# Altium project 20bit_40MS_ADC_DIOT.PrjPcb (part 3 of 5)

## Sheet Optocouplers.SchDoc: Optoisolators
size A3; Author: M.Beldyga; CompanyName: WUT ISE; DrawnBy: M.Beldyga; Organization: WUT ISE; Address1: PW ISE; Address2: Nowowiejska 15/19 00-665 Warsaw; Address3: micbeldyga@gmail.com; SheetNumber: 7; SheetTotal: 10; ModifiedBy: -; CheckedDate: -; DivGrp: WUT ISE; Designer: M.Beldyga; ModifiedDate: -; ProjectName: Sensor Box
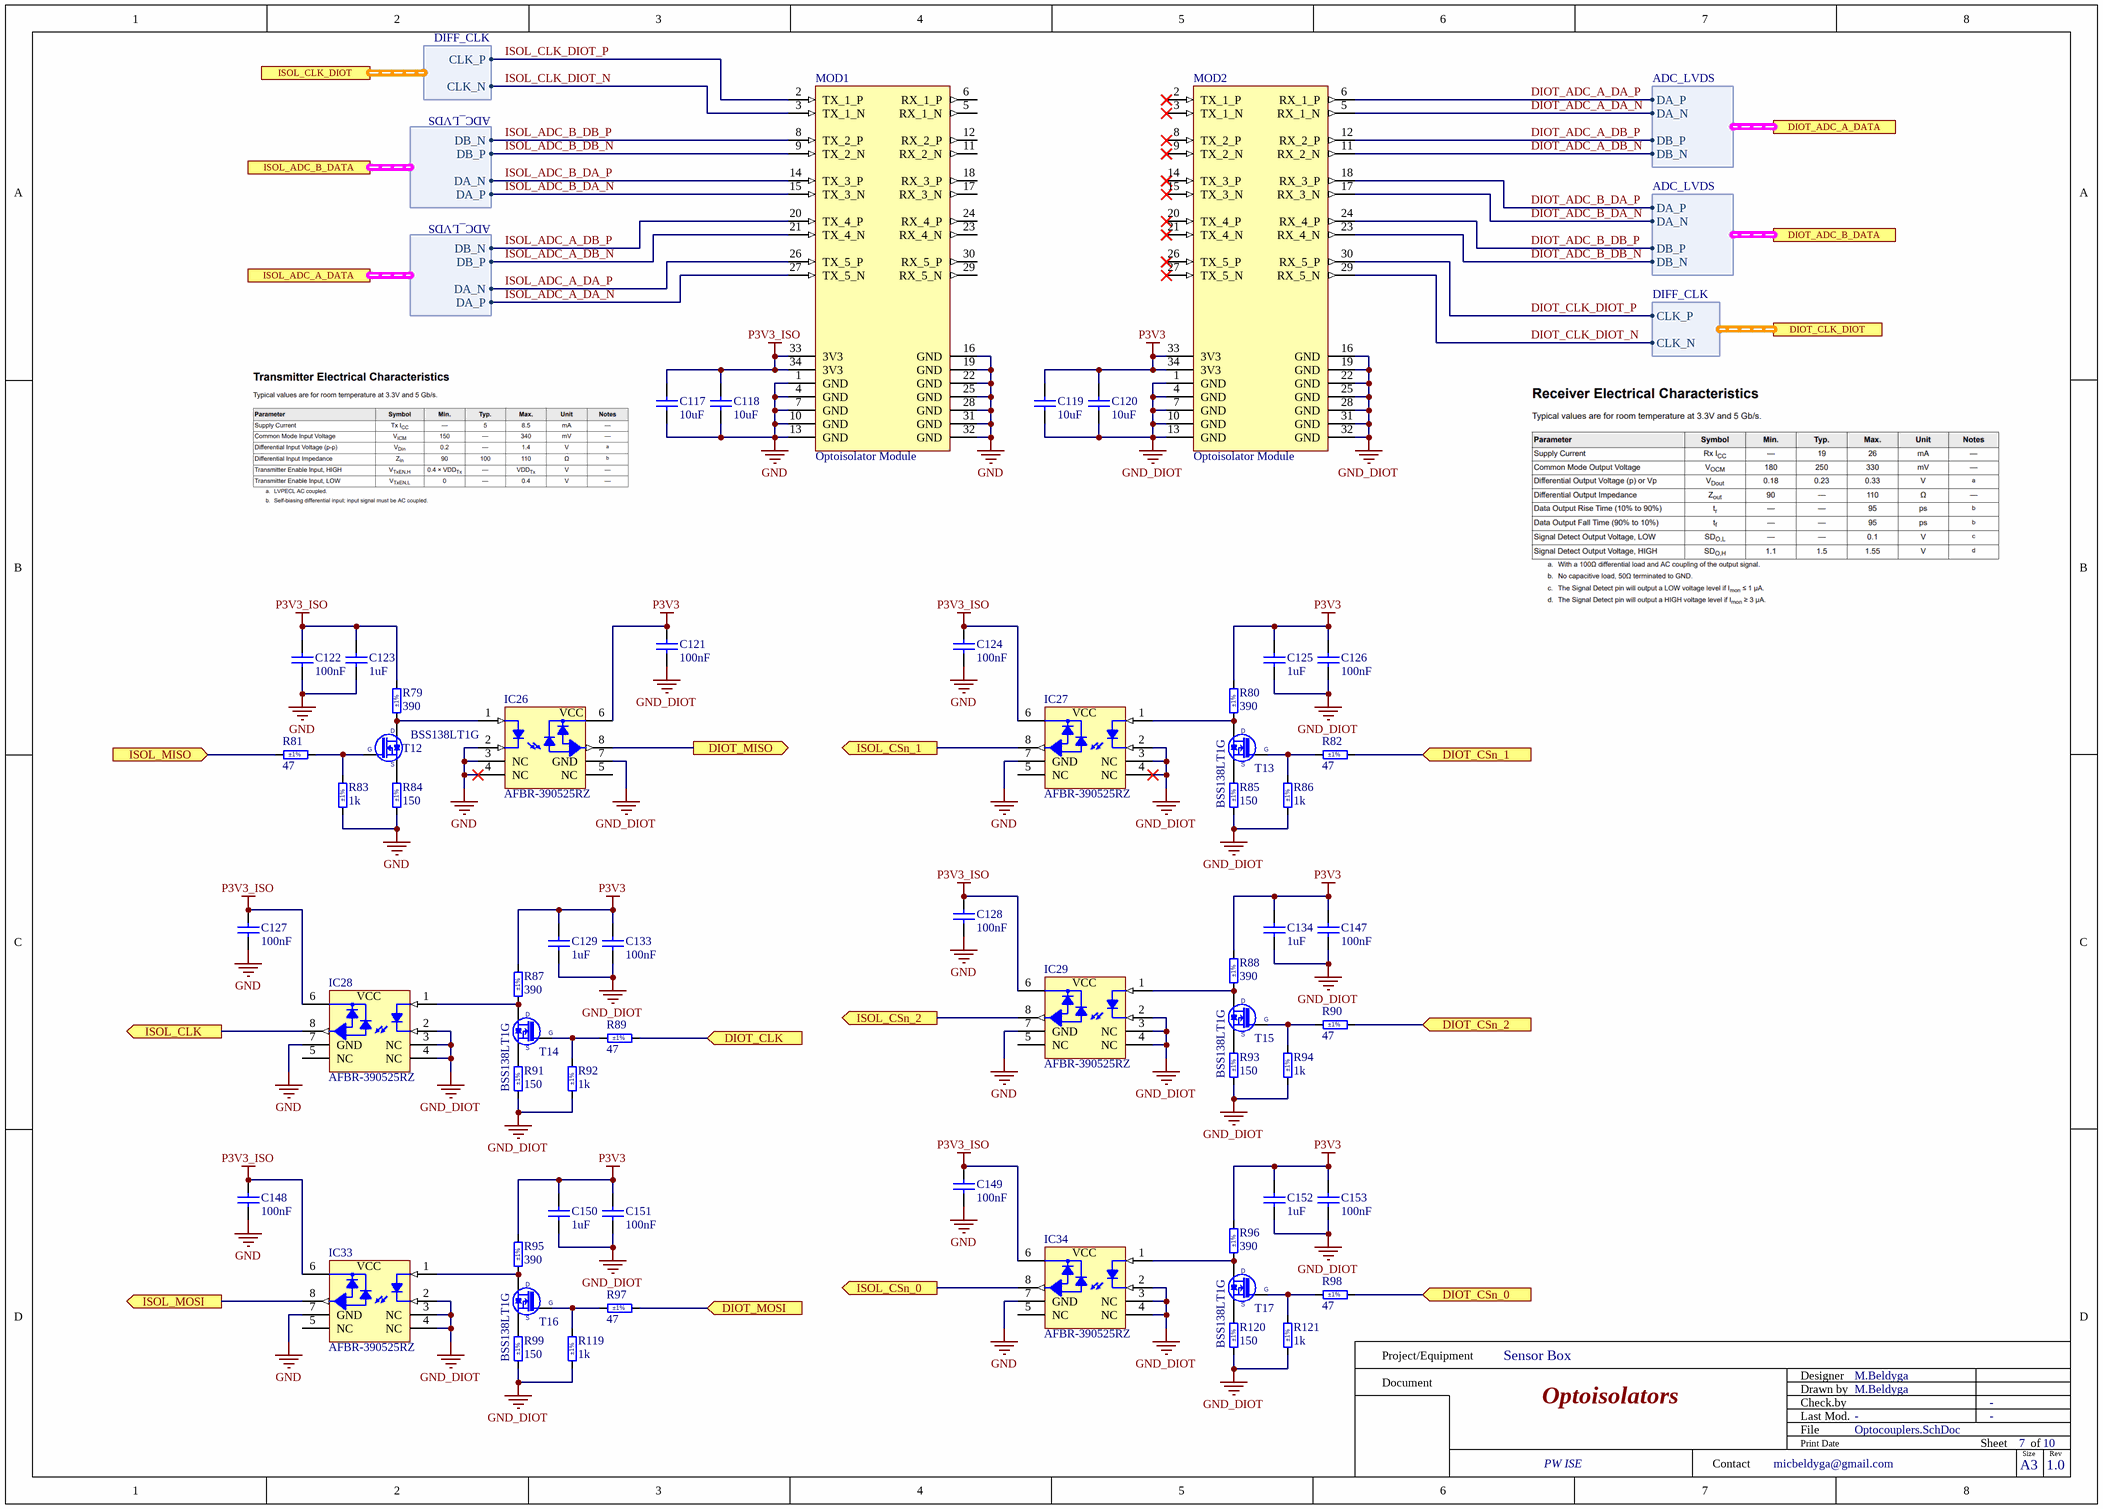
[diagram p7: Optocouplers.SchDoc]

### Parts
C117  10uF  [CAPC2012X95N]
C118  10uF  [CAPC2012X95N]
C119  10uF  [CAPC2012X95N]
C120  10uF  [CAPC2012X95N]
C121  100nF  [CAPC1005X55N]
C122  100nF  [CAPC1005X55N]
C123  1uF  [CAPC1005X55N]
C124  100nF  [CAPC1005X55N]
C125  1uF  [CAPC1005X55N]
C126  100nF  [CAPC1005X55N]
C127  100nF  [CAPC1005X55N]
C128  100nF  [CAPC1005X55N]
C129  1uF  [CAPC1005X55N]
C133  100nF  [CAPC1005X55N]
C134  1uF  [CAPC1005X55N]
C147  100nF  [CAPC1005X55N]
C148  100nF  [CAPC1005X55N]
C149  100nF  [CAPC1005X55N]
C150  1uF  [CAPC1005X55N]
C151  100nF  [CAPC1005X55N]
C152  1uF  [CAPC1005X55N]
C153  100nF  [CAPC1005X55N]
IC26  AFBR-390525RZ  [BROADCOM_AFBR-390525RZ]
IC27  AFBR-390525RZ  [BROADCOM_AFBR-390525RZ]
IC28  AFBR-390525RZ  [BROADCOM_AFBR-390525RZ]
IC29  AFBR-390525RZ  [BROADCOM_AFBR-390525RZ]
IC33  AFBR-390525RZ  [BROADCOM_AFBR-390525RZ]
IC34  AFBR-390525RZ  [BROADCOM_AFBR-390525RZ]
MOD1  Optoisolator Module  [Optoisolator_module]
MOD2  Optoisolator Module  [Optoisolator_module]
R79  390  Tolerance: ±1%  [RESC1005X40N]
R80  390  Tolerance: ±1%  [RESC1005X40N]
R81  47  Tolerance: ±1%  [RESC1005X40N]
R82  47  Tolerance: ±1%  [RESC1005X40N]
R83  1k  Tolerance: ±1%  [RESC1005X40N]
R84  150  Tolerance: ±1%  [RESC1005X40N]
R85  150  Tolerance: ±1%  [RESC1005X40N]
R86  1k  Tolerance: ±1%  [RESC1005X40N]
R87  390  Tolerance: ±1%  [RESC1005X40N]
R88  390  Tolerance: ±1%  [RESC1005X40N]
R89  47  Tolerance: ±1%  [RESC1005X40N]
R90  47  Tolerance: ±1%  [RESC1005X40N]
R91  150  Tolerance: ±1%  [RESC1005X40N]
R92  1k  Tolerance: ±1%  [RESC1005X40N]
R93  150  Tolerance: ±1%  [RESC1005X40N]
R94  1k  Tolerance: ±1%  [RESC1005X40N]
R95  390  Tolerance: ±1%  [RESC1005X40N]
R96  390  Tolerance: ±1%  [RESC1005X40N]
R97  47  Tolerance: ±1%  [RESC1005X40N]
R98  47  Tolerance: ±1%  [RESC1005X40N]
R99  150  Tolerance: ±1%  [RESC1005X40N]
R119  1k  Tolerance: ±1%  [RESC1005X40N]
R120  150  Tolerance: ±1%  [RESC1005X40N]
R121  1k  Tolerance: ±1%  [RESC1005X40N]
T12  BSS138LT1G  [SOT95P240X110-3N]
T13  BSS138LT1G  [SOT95P240X110-3N]
T14  BSS138LT1G  [SOT95P240X110-3N]
T15  BSS138LT1G  [SOT95P240X110-3N]
T16  BSS138LT1G  [SOT95P240X110-3N]
T17  BSS138LT1G  [SOT95P240X110-3N]

### Ports
DIOT_ADC_A_DATA (harness ADC_LVDS), DIOT_ADC_B_DATA (harness ADC_LVDS), DIOT_CLK (in), DIOT_CLK_DIOT (harness DIFF_CLK), DIOT_CSn_0 (in), DIOT_CSn_1 (in), DIOT_CSn_2 (in), DIOT_MISO (out), DIOT_MOSI (in), ISOL_ADC_A_DATA (harness ADC_LVDS), ISOL_ADC_B_DATA (harness ADC_LVDS), ISOL_CLK (out), ISOL_CLK_DIOT (harness DIFF_CLK), ISOL_CSn_0 (out), ISOL_CSn_1 (out), ISOL_CSn_2 (out), ISOL_MISO (in), ISOL_MOSI (out)

### Harnesses
DIFF_CLK: CLK_P, CLK_N
ADC_LVDS: DA_P, DA_N, DB_P, DB_N

### Nets
GND: C117.1 C118.1 C119.1 C120.1 C121.1 C122.1 C123.1 C124.1 C125.1 C126.1 C127.1 C128.1 C129.1 C133.1 C134.1 C147.1 C148.1 C149.1 C150.1 C151.1 C152.1 C153.1 IC26.2(C) IC26.3(NC) IC26.4(NC) IC26.7(GND) IC27.2(C) IC27.3(NC) IC27.4(NC) IC27.7(GND) IC28.2(C) IC28.3(NC) IC28.4(NC) IC28.7(GND) IC29.2(C) IC29.3(NC) IC29.4(NC) IC29.7(GND) IC33.2(C) IC33.3(NC) IC33.4(NC) IC33.7(GND) IC34.2(C) IC34.3(NC) IC34.4(NC) IC34.7(GND) MOD1.1(GND) MOD1.4(GND) MOD1.7(GND) MOD1.10(GND) MOD1.13(GND) MOD1.16(GND) MOD1.19(GND) MOD1.22(GND) MOD1.25(GND) MOD1.28(GND) MOD1.31(GND) MOD1.32(GND) MOD2.1(GND) MOD2.4(GND) MOD2.7(GND) MOD2.10(GND) MOD2.13(GND) MOD2.16(GND) MOD2.19(GND) MOD2.22(GND) MOD2.25(GND) MOD2.28(GND) MOD2.31(GND) MOD2.32(GND) R83.1 R84.1 R85.1 R86.1 R91.1 R92.1 R93.1 R94.1 R99.1 R119.1 R120.1 R121.1  [also labelled GND_DIOT]
P3V3: C119.2 C120.2 C121.2 C125.2 C126.2 C129.2 C133.2 C134.2 C147.2 C150.2 C151.2 C152.2 C153.2 IC26.6(VCC) MOD2.33(3V3) MOD2.34(3V3) R80.2 R87.2 R88.2 R95.2 R96.2
P3V3_ISO: C117.2 C118.2 C122.2 C123.2 C124.2 C127.2 C128.2 C148.2 C149.2 IC27.6(VCC) IC28.6(VCC) IC29.6(VCC) IC33.6(VCC) IC34.6(VCC) MOD1.33(3V3) MOD1.34(3V3) R79.2
ADC_SCLK: IC28.8(DATA_OUT) ; port ISOL_CLK
ADC_SDI: IC33.8(DATA_OUT) ; port ISOL_MOSI
CSn_0: IC34.8(DATA_OUT) ; port ISOL_CSn_0
CSn_1: IC27.8(DATA_OUT) ; port ISOL_CSn_1
CSn_2: IC29.8(DATA_OUT) ; port ISOL_CSn_2
DIOT_ADC_A_DA_N: MOD2.5(RX_1_N) ; port DIOT_ADC_A_DATA.DA_N
DIOT_ADC_A_DA_P: MOD2.6(RX_1_P) ; port DIOT_ADC_A_DATA.DA_P
DIOT_ADC_A_DB_N: MOD2.11(RX_2_N) ; port DIOT_ADC_A_DATA.DB_N
DIOT_ADC_A_DB_P: MOD2.12(RX_2_P) ; port DIOT_ADC_A_DATA.DB_P
DIOT_ADC_B_DA_N: MOD2.17(RX_3_N) ; port DIOT_ADC_B_DATA.DA_N
DIOT_ADC_B_DA_P: MOD2.18(RX_3_P) ; port DIOT_ADC_B_DATA.DA_P
DIOT_ADC_B_DB_N: MOD2.23(RX_4_N) ; port DIOT_ADC_B_DATA.DB_N
DIOT_ADC_B_DB_P: MOD2.24(RX_4_P) ; port DIOT_ADC_B_DATA.DB_P
DIOT_CLK_DIOT_N: MOD2.29(RX_5_N) ; port DIOT_CLK_DIOT.CLK_N
DIOT_CLK_DIOT_P: MOD2.30(RX_5_P) ; port DIOT_CLK_DIOT.CLK_P
DIOT_CSn_0: R98.2 ; port DIOT_CSn_0
DIOT_CSn_1: R82.2 ; port DIOT_CSn_1
DIOT_CSn_2: R90.2 ; port DIOT_CSn_2
DIOT_SPI_CLK: R89.2 ; port DIOT_CLK
DIOT_SPI_MISO: IC26.8(DATA_OUT) ; port DIOT_MISO
DIOT_SPI_MOSI: R97.2 ; port DIOT_MOSI
ISOL_ADC_A_DA_N: MOD1.27(TX_5_N) ; port ISOL_ADC_A_DATA.DA_P  [project net ADC_DA_P]
ISOL_ADC_A_DA_P: MOD1.26(TX_5_P) ; port ISOL_ADC_A_DATA.DA_N  [project net ADC_DA_N]
ISOL_ADC_A_DB_N: MOD1.21(TX_4_N) ; port ISOL_ADC_A_DATA.DB_P  [project net ADC_DB_P]
ISOL_ADC_A_DB_P: MOD1.20(TX_4_P) ; port ISOL_ADC_A_DATA.DB_N  [project net ADC_DB_N]
ISOL_ADC_B_DA_N: MOD1.15(TX_3_N) ; port ISOL_ADC_B_DATA.DA_P  [project net ADC_DA_P]
ISOL_ADC_B_DA_P: MOD1.14(TX_3_P) ; port ISOL_ADC_B_DATA.DA_N  [project net ADC_DA_N]
ISOL_ADC_B_DB_N: MOD1.9(TX_2_N) ; port ISOL_ADC_B_DATA.DB_P  [project net ADC_DB_P]
ISOL_ADC_B_DB_P: MOD1.8(TX_2_P) ; port ISOL_ADC_B_DATA.DB_N  [project net ADC_DB_N]
ISOL_CLK_DIOT_N: MOD1.3(TX_1_N) ; port ISOL_CLK_DIOT.CLK_N  [project net DIOT_CLK_N]
ISOL_CLK_DIOT_P: MOD1.2(TX_1_P) ; port ISOL_CLK_DIOT.CLK_P  [project net DIOT_CLK_P]
LNA_MISO: R81.2 ; port ISOL_MISO
NetIC26_1: IC26.1(A) R79.1 T12.3(D)
NetIC27_1: IC27.1(A) R80.1 T13.3(D)
NetIC28_1: IC28.1(A) R87.1 T14.3(D)
NetIC29_1: IC29.1(A) R88.1 T15.3(D)
NetIC33_1: IC33.1(A) R95.1 T16.3(D)
NetIC34_1: IC34.1(A) R96.1 T17.3(D)
NetR81_1: R81.1 R83.2 T12.1(G)
NetR82_1: R82.1 R86.2 T13.1(G)
NetR84_2: R84.2 T12.2(S)
NetR85_2: R85.2 T13.2(S)
NetR89_1: R89.1 R92.2 T14.1(G)
NetR90_1: R90.1 R94.2 T15.1(G)
NetR91_2: R91.2 T14.2(S)
NetR93_2: R93.2 T15.2(S)
NetR97_1: R97.1 R119.2 T16.1(G)
NetR98_1: R98.1 R121.2 T17.1(G)
NetR99_2: R99.2 T16.2(S)
NetR120_2: R120.2 T17.2(S)

Not connected (* = marked no-connect by the designer): IC26 5(NC); IC27 5(NC); IC28 5(NC); IC29 5(NC); IC33 5(NC); IC34 5(NC); MOD1 5(RX_1_N) 6(RX_1_P) 11(RX_2_N) 12(RX_2_P) 17(RX_3_N) 18(RX_3_P) 23(RX_4_N) 24(RX_4_P) 29(RX_5_N) 30(RX_5_P); MOD2 2(TX_1_P)* 3(TX_1_N)* 8(TX_2_P)* 9(TX_2_N)* 14(TX_3_P)* 15(TX_3_N)* 20(TX_4_P)* 21(TX_4_N)* 26(TX_5_P)* 27(TX_5_N)*

### Notes on the sheet
- Project/Equipment
- Document
- Designer
- Drawn by
- Check.by
- Contact
- File
- Last Mod.
- Print Date
- Sheet
- Size
- A3
- of
- Rev

### Library data of the parts
C117-C120 = CC0805_10UF_25V_10%_X5R: Non-polarised capacitor; Part Description: SMD Multilayer Chip Ceramic Capacitor; Manufacturer: GENERIC; Manufacturer1 Part Number: GRM219R61E106KA12D; Voltage: 25V; TC: X5R; Tolerance: ±10%; Part Number: CC0805_10UF_25V_10%_X5R; Component Kind: Standard; Component Type: Standard; Pin Count: 2; Value: 10uF; Status: Preferred; Manufacturer Part Number: CC0805_10UF_25V_10%_X5R; Case: 0805; Mounted: Yes; Socket: No; SMD: Yes; Sense: No; Manufacturer1 Example: MURATA; Manufacturer1 ComponentHeight: 0.95mm; HelpURL: \\cern.ch\dfs\Applications\Altium\Datasheets\CC0805_X5R_MURATA_GRM.pdf; Author: CERN DEM JLC; CreateDate: 10/25/2012; LatestRevisionDate: 9/6/2016
C121 C122 C124 C126-C128 C133 C147-C149 C151 C153 = CC0402_100NF_50V_10%_X7R: Non-polarised capacitor; Part Description: SMD Multilayer Chip Ceramic Capacitor; Manufacturer: GENERIC; Manufacturer1 Part Number: GRM155R71H104KE14D; Voltage: 50V; TC: X7R; Tolerance: ±10%; Part Number: CC0402_100NF_50V_10%_X7R; Component Kind: Standard; Component Type: Standard; Pin Count: 2; Value: 100nF; Status: None; Manufacturer Part Number: CC0402_100NF_50V_10%_X7R; Case: 0402; Mounted: Yes; Socket: No; SMD: Yes; Sense: No; Manufacturer1 Example: MURATA; Manufacturer1 ComponentHeight: 0.55mm; HelpURL: \\cern.ch\dfs\Applications\Altium\Datasheets\CC0402_MURATA_GRM155R71H104KE14D.pdf; Author: CERN DEM MR; CreateDate: 6/30/2017; LatestRevisionDate: 6/30/2017
C123 C125 C129 C134 C150 C152 = CC0402_1UF_16V_10%_X5R: Non-polarised capacitor; Part Description: SMD Multilayer Chip Ceramic Capacitor; Manufacturer: GENERIC; Manufacturer1 Part Number: C1005X5R1C105KT; Voltage: 16V; TC: X5R; Tolerance: ±10%; Part Number: CC0402_1UF_16V_10%_X5R; Component Kind: Standard; Component Type: Standard; Pin Count: 2; Value: 1uF; Status: Preferred; Manufacturer Part Number: CC0402_1UF_16V_10%_X5R; Case: 0402; Mounted: Yes; Socket: No; SMD: Yes; Sense: No; Manufacturer1 Example: TDK; Manufacturer1 ComponentHeight: 0.55mm; HelpURL: \\cern.ch\dfs\Applications\Altium\Datasheets\CC0402_X5R_TDK_C.pdf; Author: CERN DEM JLC; CreateDate: 10/25/2012; LatestRevisionDate: 10/25/2012
IC26-IC29 IC33 IC34 = AFBR-390525RZ: High Voltage Galvanic Insulation Link for DC to 5MBaud; Part Description: High Voltage Galvanic Insulation Link for DC to 5MBaud, Length 25mm, 15kV Voltage Suppression; Manufacturer: BROADCOM; PressFit: No; Bonding: No; Part Number: AFBR-390525RZ; Component Kind: Standard; Component Type: Standard; Device: AFBR-390525RZ; PackageDescription: BROADCOM AFBR-390525RZ Case, Body 30.46mm L X 10.16mm W X 6.7mm H; Manufacturer Part Number: AFBR-390525RZ; Pin Count: 8; Mounted: Yes; Socket: No; SMD: No; Sense: No; ComponentHeight: 6.7mm; HelpURL: \\cern.ch\dfs\Applications\Altium\Datasheets\AFBR-390525RZ.pdf; Author: CERN DEM HF; CreateDate: 2/10/2022; LatestRevisionDate: 3/21/2022
MOD1 MOD2 = ADC_40M_20b_optoisolator: 5X AFBR-FS50B00. AC coupled, 100Ω terminated
R79 R80 R87 R88 R95 R96 = R0402_390R_1%_0.0625W_100PPM: Resistor - 1%; Part Description: General Purpose Thick Film Chip Resistor; Manufacturer: GENERIC; Manufacturer1 Part Number: 232270673901L; TC: ±100ppm/°C; PressFit: No; Part Number: R0402_390R_1%_0.0625W_100PPM; Component Kind: Standard; Component Type: Standard; Pin Count: 2; Value: 390; Status: Not Recommended; Power: 0.0625W; Manufacturer Part Number: R0402_390R_1%_0.0625W_100PPM; Case: 0402; Mounted: Yes; Sense: No; Socket: No; SMD: Yes; Manufacturer1 Example: YAGEO PHYCOMP; Manufacturer1 ComponentHeight: 0.4mm; HelpURL: \\cern.ch\dfs\Applications\Altium\Datasheets\R0402_Phycomp_RC0402.pdf; Author: CERN DEM JLC; CreateDate: 12/3/2007; LatestRevisionDate: 10/17/2012
R81 R82 R89 R90 R97 R98 = R0402_47R_1%_0.0625W_100PPM: Resistor - 1%; Part Description: General Purpose Thick Film Chip Resistor; Manufacturer: GENERIC; Manufacturer1 Part Number: 232270674709L; TC: ±100ppm/°C; PressFit: No; Part Number: R0402_47R_1%_0.0625W_100PPM; Component Kind: Standard; Component Type: Standard; Pin Count: 2; Value: 47; Status: Not Recommended; Power: 0.0625W; Manufacturer Part Number: R0402_47R_1%_0.0625W_100PPM; Case: 0402; Mounted: Yes; Sense: No; Socket: No; SMD: Yes; Manufacturer1 Example: YAGEO PHYCOMP; Manufacturer1 ComponentHeight: 0.4mm; HelpURL: \\cern.ch\dfs\Applications\Altium\Datasheets\R0402_Phycomp_RC0402.pdf; Author: CERN DEM JLC; CreateDate: 12/3/2007; LatestRevisionDate: 10/17/2012
R83 R86 R92 R94 R119 R121 = R0402_1K_1%_0.0625W_100PPM: Resistor - 1%; Part Description: General Purpose Thick Film Chip Resistor; Manufacturer: GENERIC; Manufacturer1 Part Number: 232270671002L; TC: ±100ppm/°C; PressFit: No; Part Number: R0402_1K_1%_0.0625W_100PPM; Component Kind: Standard; Component Type: Standard; Pin Count: 2; Value: 1k; Status: Not Recommended; Power: 0.0625W; Manufacturer Part Number: R0402_1K_1%_0.0625W_100PPM; Case: 0402; Mounted: Yes; Sense: No; Socket: No; SMD: Yes; Manufacturer1 Example: YAGEO PHYCOMP; Manufacturer1 ComponentHeight: 0.4mm; HelpURL: \\cern.ch\dfs\Applications\Altium\Datasheets\R0402_Phycomp_RC0402.pdf; Author: CERN DEM JLC; CreateDate: 12/3/2007; LatestRevisionDate: 10/17/2012
R84 R85 R91 R93 R99 R120 = R0402_150R_1%_0.0625W_100PPM: Resistor - 1%; Part Description: General Purpose Thick Film Chip Resistor; Manufacturer: GENERIC; Manufacturer1 Part Number: 232270671501L; TC: ±100ppm/°C; PressFit: No; Part Number: R0402_150R_1%_0.0625W_100PPM; Component Kind: Standard; Component Type: Standard; Pin Count: 2; Value: 150; Status: Not Recommended; Power: 0.0625W; Manufacturer Part Number: R0402_150R_1%_0.0625W_100PPM; Case: 0402; Mounted: Yes; Sense: No; Socket: No; SMD: Yes; Manufacturer1 Example: YAGEO PHYCOMP; Manufacturer1 ComponentHeight: 0.4mm; HelpURL: \\cern.ch\dfs\Applications\Altium\Datasheets\R0402_Phycomp_RC0402.pdf; Author: CERN DEM JLC; CreateDate: 12/3/2007; LatestRevisionDate: 10/17/2012
T12-T17 = BSS138LT1G: N-CHANNEL MOSFET WITH DIODE; Part Description: 50V 200mA N-Channel Enhancement Mode Field-Effect Transistor; Manufacturer: ON SEMICONDUCTOR; PressFit: No; Bonding: No; Part Number: BSS138LT1G; Component Kind: Standard; Component Type: Standard; Device: BSS138LT1G; PackageDescription: SOT23 3-Leads, Pitch 0.95mm - Body 1.4x3mm, IPC Medium Density; Manufacturer Part Number: BSS138LT1G; Pin Count: 3; Case: SOT23-3; Mounted: Yes; Socket: No; SMD: Yes; Sense: No; ComponentHeight: 1.11mm; HelpURL: \\cern.ch\dfs\Applications\Altium\Datasheets\BSS138LT1G.pdf; Author: CERN DEM JLC; CreateDate: 23.03.2009; LatestRevisionDate: 23.03.2009

## Sheet EEM_Connectors.SchDoc: EEM
size 420 x 297 mm; EDA_Number: ARTIQ; SPICEModelCacheVGBTAUBO: <root> / <DocumentId>VGBTAUBO</DocumentId> / <CacheFrame Number="0"> / <Model Name="pk14" Kind="CKT"> / <Text>*.INC dhvqfn.s / .SUBCKT pk14 / +    1   2   3   4   5   6   7   8   9  10 / +   11  12  13  14 / +   15  16  17  18  19  20  21  22  23  24 / +   25  26  27  28 / * Pin Resistance / r1 1 1001 9.078E-02 / r2 2 1002 8.829E-02 / r3 3 1003 8.731E-02 / r4 4 1004 8.710E-02 / r5 5 1005 8.731E-02 / r6 6 1006 8.829E-02 / r7 7 1007 9.075E-02 / r8 8 1008 9.072E-02 / r9 9 1009 8.809E-02 / r10 10 1010 8.716E-02 / r11 11 1011 8.706E-02 / r12 12 1012 8.720E-02 / r13 13 1013 8.816E-02 / r14 14 1014 9.068E-02 / * Pin Inductance / l1 1001 15 2.981E-09 / l2 1002 16 2.447E-09 / l3 1003 17 2.304E-09 / l4 1004 18 2.291E-09 / l5 1005 19 2.307E-09 / l6 1006 20 2.449E-09 / l7 1007 21 2.971E-09 / l8 1008 22 2.972E-09 / l9 1009 23 2.425E-09 / l10 1010 24 2.286E-09 / l11 1011 25 2.280E-09 / l12 1012 26 2.286E-09 / l13 1013 27 2.425E-09 / l14 1014 28 2.975E-09 / .ENDS pk14</Text> / </Model> / </CacheFrame> / </root>; CheckedBy: P.Kulik; Author: G.Kasprowicz; CompanyName: WUT ISE; DrawnBy: G.Kasprowicz; Organization: WUT ISE; Address1: PW ISE; Address2: Nowowiejska 15/19 00-665 Warsaw; Address3: gkasprow@gmail.com; Revision: 2; SheetNumber: 10; SheetTotal: 10; ModifiedBy: -; CheckedDate: -; Title2: Connectors; DivGrp: WUT ISE; Designer: G.Kasprowicz; ModifiedDate: -; ProjectName: Sensor Box
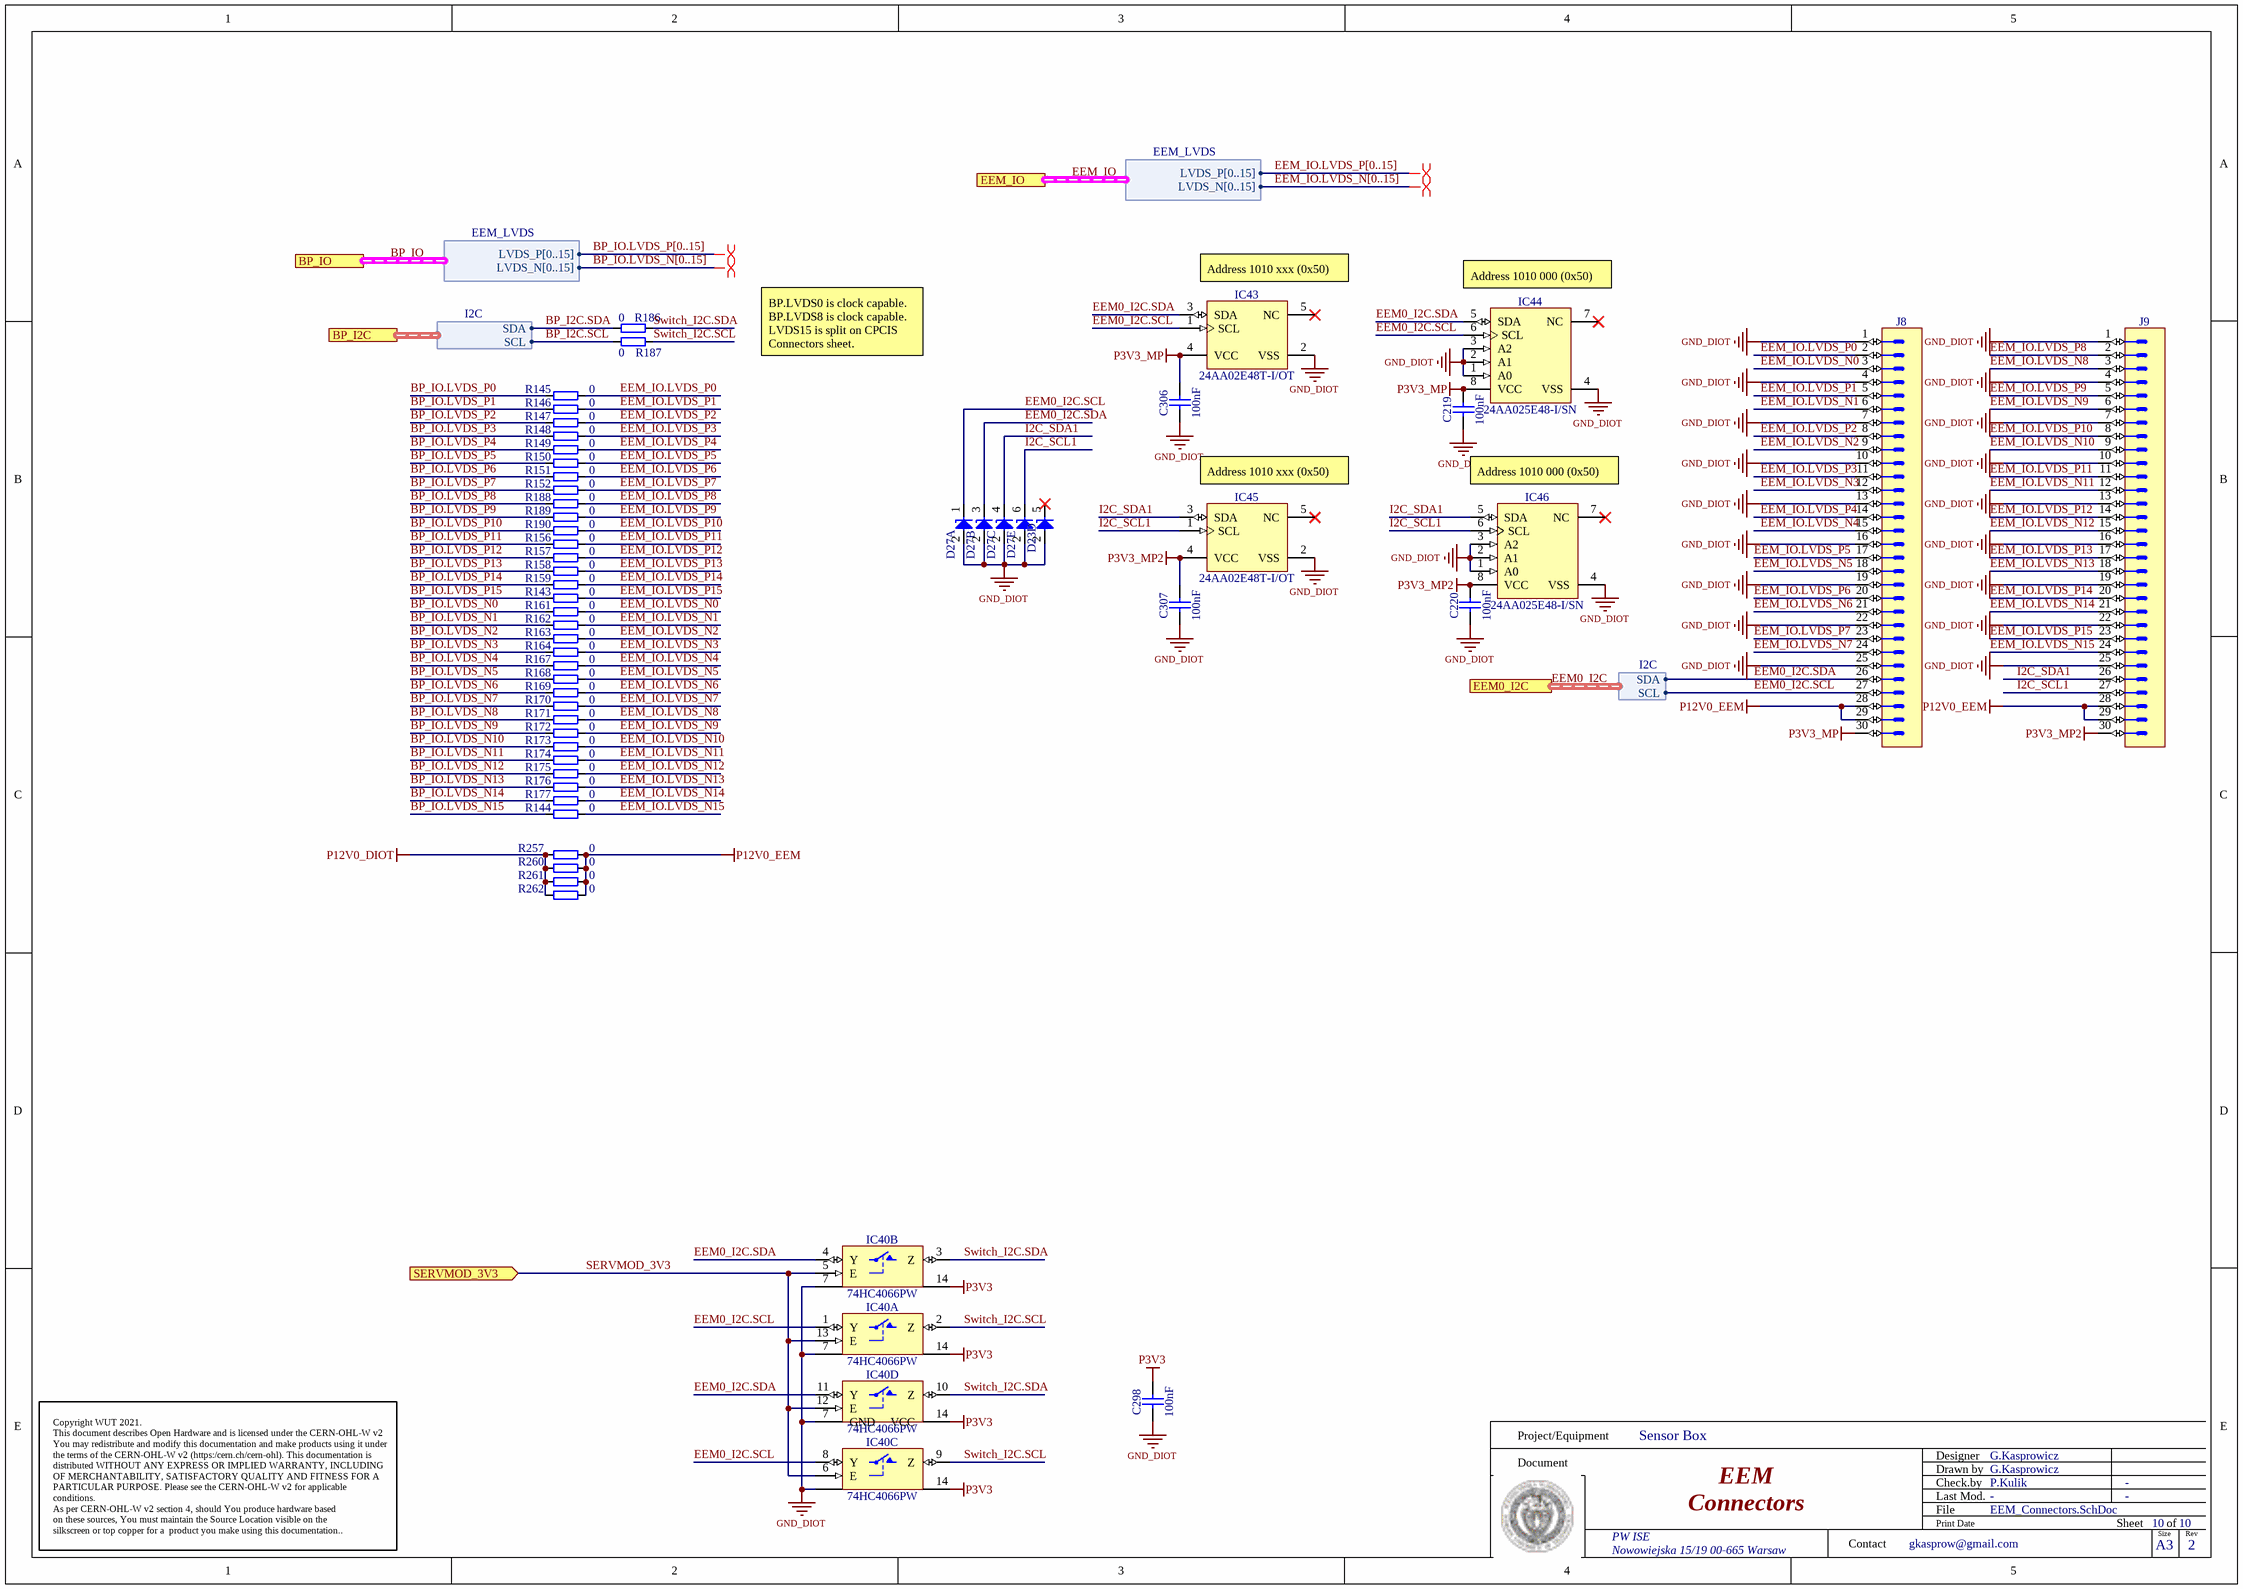
[diagram p8: EEM_Connectors.SchDoc]

### Parts
C219  100nF  [CAPC1005X55N]
C220  100nF  [CAPC1005X55N]
C298  100nF  [CAPC1005X55N]
C306  100nF  [CAPC1005X55N]
C307  100nF  [CAPC1005X55N]
D23  PESD3V3L5UY  [SOT65P210X110-6N]  (value not drawn)  (part D of 5)
D27  PESD3V3L5UY  [SOT65P210X110-6N]  (value not drawn)  (parts A,B,C,E of 5)
IC40  74HC4066PW  [SOP65P640X110-14N]  (parts A,B,C,D of 4)
IC43  24AA02E48T-I/OT  [SOT95P280X145-5N]
IC44  24AA025E48-I/SN  [SOIC127P600X175-8N]
IC45  24AA02E48T-I/OT  [SOT95P280X145-5N]
IC46  24AA025E48-I/SN  [SOIC127P600X175-8N]
J8  (no value)  [3M_N2530-6002RB]
J9  (no value)  [3M_N2530-6002RB]
R143  0  [RESC1005X40N]
R144  0  [RESC1005X40N]
R145  0  [RESC1005X40N]
R146  0  [RESC1005X40N]
R147  0  [RESC1005X40N]
R148  0  [RESC1005X40N]
R149  0  [RESC1005X40N]
R150  0  [RESC1005X40N]
R151  0  [RESC1005X40N]
R152  0  [RESC1005X40N]
R156  0  [RESC1005X40N]
R157  0  [RESC1005X40N]
R158  0  [RESC1005X40N]
R159  0  [RESC1005X40N]
R161  0  [RESC1005X40N]
R162  0  [RESC1005X40N]
R163  0  [RESC1005X40N]
R164  0  [RESC1005X40N]
R167  0  [RESC1005X40N]
R168  0  [RESC1005X40N]
R169  0  [RESC1005X40N]
R170  0  [RESC1005X40N]
R171  0  [RESC1005X40N]
R172  0  [RESC1005X40N]
R173  0  [RESC1005X40N]
R174  0  [RESC1005X40N]
R175  0  [RESC1005X40N]
R176  0  [RESC1005X40N]
R177  0  [RESC1005X40N]
R186  0  [RESC1005X40N]
R187  0  [RESC1005X40N]
R188  0  [RESC1005X40N]
R189  0  [RESC1005X40N]
R190  0  [RESC1005X40N]
R257  0  [RESC1005X40N]
R260  0  [RESC1005X40N]
R261  0  [RESC1005X40N]
R262  0  [RESC1005X40N]

### Ports
BP_I2C (harness I2C), BP_IO (harness EEM_LVDS), EEM0_I2C (harness I2C), EEM_IO (harness EEM_LVDS), SERVMOD_3V3 (in)

### Harnesses
I2C: SDA, SCL
EEM_LVDS: LVDS_P[0..15], LVDS_N[0..15]

### Nets
GND: C219.1 C220.1 C298.1 C306.1 C307.1 D23.2(A) D27.2(A) IC40.7(GND) IC43.2(VSS) IC44.1(A0) IC44.2(A1) IC44.3(A2) IC44.4(VSS) IC45.2(VSS) IC46.1(A0) IC46.2(A1) IC46.3(A2) IC46.4(VSS) J8.1 J8.4 J8.7 J8.10 J8.13 J8.16 J8.19 J8.22 J8.25 J9.1 J9.4 J9.7 J9.10 J9.13 J9.16 J9.19 J9.22 J9.25  [also labelled GND_DIOT]
P3V3: C298.2 IC40.14(VCC)
P3V3_MP: C219.2 C306.2 IC43.4(VCC) IC44.8(VCC) J8.30
P3V3_MP2: C220.2 C307.2 IC45.4(VCC) IC46.8(VCC) J9.30
P12V0_DIOT: R257.1 R260.1 R261.1 R262.1
P12V0_EEM: J8.28 J8.29 J9.28 J9.29 R257.2 R260.2 R261.2 R262.2
BP_I2C.SCL: R187.1 ; port BP_I2C.SCL
BP_I2C.SDA: R186.1 ; port BP_I2C.SDA
BP_IO.LVDS_N0: R161.1
BP_IO.LVDS_N1: R162.1
BP_IO.LVDS_N2: R163.1
BP_IO.LVDS_N3: R164.1
BP_IO.LVDS_N4: R167.1
BP_IO.LVDS_N5: R168.1
BP_IO.LVDS_N6: R169.1
BP_IO.LVDS_N7: R170.1
BP_IO.LVDS_N8: R171.1
BP_IO.LVDS_N9: R172.1
BP_IO.LVDS_N10: R173.1
BP_IO.LVDS_N11: R174.1
BP_IO.LVDS_N12: R175.1
BP_IO.LVDS_N13: R176.1
BP_IO.LVDS_N14: R177.1
BP_IO.LVDS_N15: R144.2
BP_IO.LVDS_P0: R145.1
BP_IO.LVDS_P1: R146.1
BP_IO.LVDS_P2: R147.1
BP_IO.LVDS_P3: R148.1
BP_IO.LVDS_P4: R149.1
BP_IO.LVDS_P5: R150.1
BP_IO.LVDS_P6: R151.1
BP_IO.LVDS_P7: R152.1
BP_IO.LVDS_P8: R188.1
BP_IO.LVDS_P9: R189.1
BP_IO.LVDS_P10: R190.1
BP_IO.LVDS_P11: R156.1
BP_IO.LVDS_P12: R157.1
BP_IO.LVDS_P13: R158.1
BP_IO.LVDS_P14: R159.1
BP_IO.LVDS_P15: R143.2
EEM0_I2C.SCL: D27.1(C) IC40.1(Y) IC40.8(Y) IC43.1(SCL) IC44.6(SCL) J8.27 ; port EEM0_I2C.SCL
EEM0_I2C.SDA: D27.3(C) IC40.4(Y) IC40.11(Y) IC43.3(SDA) IC44.5(SDA) J8.26 ; port EEM0_I2C.SDA
EEM_IO.LVDS_N0: J8.3 R161.2  [project net DIOT_CLK_DIOT_N]
EEM_IO.LVDS_N1: J8.6 R162.2  [project net DIOT_ADC_A_DA_N]
EEM_IO.LVDS_N2: J8.9 R163.2  [project net DIOT_ADC_A_DB_N]
EEM_IO.LVDS_N3: J8.12 R164.2  [project net DIOT_ADC_B_DA_N]
EEM_IO.LVDS_N4: J8.15 R167.2  [project net DIOT_ADC_B_DB_N]
EEM_IO.LVDS_N5: J8.18 R168.2
EEM_IO.LVDS_N6: J8.21 R169.2
EEM_IO.LVDS_N7: J8.24 R170.2
EEM_IO.LVDS_N8: J9.3 R171.2
EEM_IO.LVDS_N9: J9.6 R172.2
EEM_IO.LVDS_N10: J9.9 R173.2
EEM_IO.LVDS_N11: J9.12 R174.2
EEM_IO.LVDS_N12: J9.15 R175.2
EEM_IO.LVDS_N13: J9.18 R176.2
EEM_IO.LVDS_N14: J9.21 R177.2
EEM_IO.LVDS_N15: J9.24 R144.1
EEM_IO.LVDS_P0: J8.2 R145.2  [project net DIOT_CLK_DIOT_P]
EEM_IO.LVDS_P1: J8.5 R146.2  [project net DIOT_ADC_A_DA_P]
EEM_IO.LVDS_P2: J8.8 R147.2  [project net DIOT_ADC_A_DB_P]
EEM_IO.LVDS_P3: J8.11 R148.2  [project net DIOT_ADC_B_DA_P]
EEM_IO.LVDS_P4: J8.14 R149.2  [project net DIOT_ADC_B_DB_P]
EEM_IO.LVDS_P5: J8.17 R150.2
EEM_IO.LVDS_P6: J8.20 R151.2
EEM_IO.LVDS_P7: J8.23 R152.2
EEM_IO.LVDS_P8: J9.2 R188.2
EEM_IO.LVDS_P9: J9.5 R189.2
EEM_IO.LVDS_P10: J9.8 R190.2
EEM_IO.LVDS_P11: J9.11 R156.2
EEM_IO.LVDS_P12: J9.14 R157.2
EEM_IO.LVDS_P13: J9.17 R158.2
EEM_IO.LVDS_P14: J9.20 R159.2
EEM_IO.LVDS_P15: J9.23 R143.1
I2C_SCL1: D27.6(C) IC45.1(SCL) IC46.6(SCL) J9.27
I2C_SDA1: D27.4(C) IC45.3(SDA) IC46.5(SDA) J9.26
SERVMOD_3V3: IC40.5(E) IC40.6(E) IC40.12(E) IC40.13(E) ; port SERVMOD_3V3
Switch_I2C.SCL: IC40.2(Z) IC40.9(Z) R187.2
Switch_I2C.SDA: IC40.3(Z) IC40.10(Z) R186.2

Not connected (* = marked no-connect by the designer): D23 5(C)*; IC43 5(NC)*; IC44 7(NC)*; IC45 5(NC)*; IC46 7(NC)*

### Buses and harness runs
bus BP_IO.LVDS_N[0..15]
bus BP_IO.LVDS_P[0..15]
bus EEM_IO.LVDS_N[0..15]
bus EEM_IO.LVDS_P[0..15]
harness BP_IO = port BP_IO
harness EEM0_I2C = port EEM0_I2C
harness EEM_IO = port EEM_IO

### Layout directives
differential pair; net class D100: (no net found under the mark)

### Notes on the sheet
- (near IC43) Address 1010 xxx (0x50)
- (near IC44) Address 1010 000 (0x50)
- BP.LVDS0 is clock capable.
  BP.LVDS8 is clock capable.
  LVDS15 is split on CPCIS Connectors sheet.
- Address 1010 xxx (0x50)
- Address 1010 000 (0x50)
- Project/Equipment
- Document
- Designer
- Drawn by
- Check.by
- Contact
- File
- Last Mod.
- Print Date
- Sheet
- Size
- A3
- of
- Rev
- Copyright WUT 2021.
  This document describes Open Hardware and is licensed under the CERN-OHL-W v2
  You may redistribute and modify this documentation and make products using it under the terms of the CERN-OHL-W v2 (https:/cern.ch/cern-ohl). This documentation is distributed WITHOUT ANY EXPRESS OR IMPLIED WARRANTY, INCLUDING OF MERCHANTABILITY, SATISFACTORY QUALITY AND FITNESS FOR A PARTICULAR PURPOSE. Please see the CERN-OHL-W v2 for applicable conditions.
  As per CERN-OHL-W v2 section 4, should You produce hardware based
  on these sources, You must maintain the Source Location visible on the
  silkscreen or top copper for a  product you make using this documentation..

### Library data of the parts
C219 C220 C298 C306 C307 = CC0402_100NF_50V_10%_X7R: as C121 on sheet Optocouplers; Part Number: CC0402_100NF_50V_10%_X7R; Component Kind: Standard; Component Type: Standard; Pin Count: 2; Value: 100nF; Status: None; Manufacturer Part Number: CC0402_100NF_50V_10%_X7R; Case: 0402; Mounted: Yes; Socket: No; SMD: Yes; Sense: No; HelpURL: \\cern.ch\dfs\Applications\Altium\Datasheets\CC0402_MURATA_GRM155R71H104KE14D.pdf; Author: CERN DEM MR; CreateDate: 30.06.2017; LatestRevisionDate: 30.06.2017; Manufacturer1 Example: MURATA; Manufacturer1 ComponentHeight: 0.55mm
D23 D27 = PESD3V3L5UY: Fivefold ESD Protection Diode Arrays; Part Description: Fivefold ESD Protection Diode Arrays (30kV); Manufacturer: NEXPERIA; Voltage: 3.3V; Power: 200W; PressFit: No; Bonding: No; Part Number: PESD3V3L5UY; Component Kind: Standard; Component Type: Standard; Device: PESD3V3L5UY; PackageDescription: SOT363, SC-88, 0.65mm Pitch; 6 Pin, 1.25mm W X 2.00mm L X 1.10mm H body, IPC Medium Density; Manufacturer Part Number: PESD3V3L5UY; Pin Count: 6; Case: SOT363; Mounted: Yes; Socket: No; SMD: Yes; Sense: No; ComponentHeight: 1.1mm; HelpURL: \\cern.ch\dfs\Applications\Altium\Datasheets\PESD3V3L5UY.pdf; Author: CERN DEM WB; CreateDate: 05.07.2021; LatestRevisionDate: 05.07.2021
IC40 = 74HC4066PW: Part Description: Quad Single-Pole Single-Throw Analog Switch; Manufacturer: NXP SEMICONDUCTORS; PressFit: No; Bonding: No; Table: Standard Logic; Part Number: 74HC4066PW; Component Kind: Standard; Component Type: Standard; Device: 74HC4066PW; PackageDescription: SOP, 14-Leads, Body 4.4x5mm (max), Pitch 0.65mm, IPC Medium Density; Manufacturer Part Number: 74HC4066PW; Pin Count: 14; Case: TSSOP14; Mounted: Yes; Socket: No; SMD: Yes; ComponentHeight: 1.1mm; Author: CERN DEM JLC; HelpURL: \\cern.ch\dfs\Applications\Altium\Datasheets\74HC4066PW.pdf; CreateDate: 2014-11-19; LatestRevisionDate: 2014-11-19
IC43 IC45 = 24AA02E48T-I/OT: 1.7V-5.5V, 2K I2C Serial EEPROM With EUI-48 Node Identity; Manufacturer: MICROCHIP TECHNOLOGY; PressFit: No; Bonding: No; Part Number: 24AA02E48T-I/OT; Component Kind: Standard; Component Type: Standard; Device: 24AA02E48T-I/OT; PackageDescription: SOT, 0.95mm pitch; 5 pin, 1.60mm W X 2.90mm L X 1.45mm H body, IPC Medium Density; Part Description: 1.7V-5.5V, 2K I2C Serial EEPROM with EUI-48 Node Identity; Manufacturer Part Number: 24AA02E48T-I/OT; Pin Count: 5; Case: SOT23-5; Mounted: Yes; Socket: No; SMD: Yes; Sense: No; ComponentHeight: 1.45mm; HelpURL: \\cern.ch\dfs\Applications\Altium\Datasheets\24AA02E48T-I-OT.pdf; Author: CERN DEM MR; CreateDate: 31.03.2016; LatestRevisionDate: 31.03.2016
IC44 IC46 = 24AA025E48-I/SN: 1.7V-5.5V, 2K I2C™ Serial EEPROMs with EUI-48™ Node Identity; Manufacturer: MICROCHIP TECHNOLOGY; PressFit: No; Bonding: No; Part Number: 24AA025E48-I/SN; Component Kind: Standard; Component Type: Standard; Device: 24AA025E48-I/SN; PackageDescription: SOIC 8, Pitch 1.27mm - Body 4x5mm, IPC Medium Density; Part Description: 1.7V-5.5V, 2K I2C™ Serial EEPROMs with EUI-48™ Node Identity; Manufacturer Part Number: 24AA025E48-I/SN; Pin Count: 8; Case: SOIC8; Mounted: Yes; Socket: No; SMD: Yes; Sense: No; ComponentHeight: 1.75mm; HelpURL: \\cern.ch\dfs\Applications\Altium\Datasheets\24AA025E48-I-SN.pdf; Author: CERN DEM MR; CreateDate: 19.07.2016; LatestRevisionDate: 19.07.2016
J8 J9 = 3M_N2530-6002RB: Connector 30 Male; Part Description: 30 Contacts - Straight .100'' x .100'' Low Profile Four-Wall Header, 2500 Series; Manufacturer: 3M; PressFit: No; Part Number: 3M_N2530-6002RB; Component Kind: Standard; Component Type: Standard; Pin Count: 30; Family: Header 30; Mounted: Yes; Socket: No; SMD: No; Sense: No; Status: None; Manufacturer Part Number: N2530-6002RB; ComponentHeight: 10.03mm; HelpURL: \\cern.ch\dfs\Applications\Altium\Datasheets\3M_N2530-6002RB.pdf; Author: CERN DEM JLC; CreateDate: 11.02.2009; LatestRevisionDate: 11.08.2009
R143-R152 R156-R159 R161-R164 R167-R177 R186-R190 R257 R260-R262 = R0402_0R_JUMPER: Resistor; Part Description: 1A (0.05R Max DC Resistance) Zero Ohm Jumper; Manufacturer: GENERIC; Manufacturer1 Part Number: 232270591001L; PressFit: No; Part Number: R0402_0R_JUMPER; Component Kind: Standard; Component Type: Standard; Pin Count: 2; Value: 0; Status: Not Recommended; Manufacturer Part Number: R0402_0R_JUMPER; Case: 0402; Mounted: Yes; Sense: No; Socket: No; SMD: Yes; Manufacturer1 Example: YAGEO PHYCOMP; Manufacturer1 ComponentHeight: 0.4mm; HelpURL: \\cern.ch\dfs\Applications\Altium\Datasheets\R0402_Phycomp_RC0402.pdf; Author: CERN DEM JLC; CreateDate: 03.12.2007; LatestRevisionDate: 17.10.2012

## Sheet Isolated_Power_supply.SchDoc: Power Supply
size A2; Author: M.Beldyga; CompanyName: WUT ISE; DrawnBy: M.Beldyga; Organization: WUT ISE; Address1: PW ISE; Address2: Nowowiejska 15/19 00-665 Warsaw; Address3: micbeldyga@gmail.com; SheetNumber: 8; SheetTotal: 10; ModifiedBy: -; CheckedDate: -; Title2: LLC + LDO; DivGrp: WUT ISE; Designer: M.Beldyga; ModifiedDate: -; ProjectName: Sensor Box
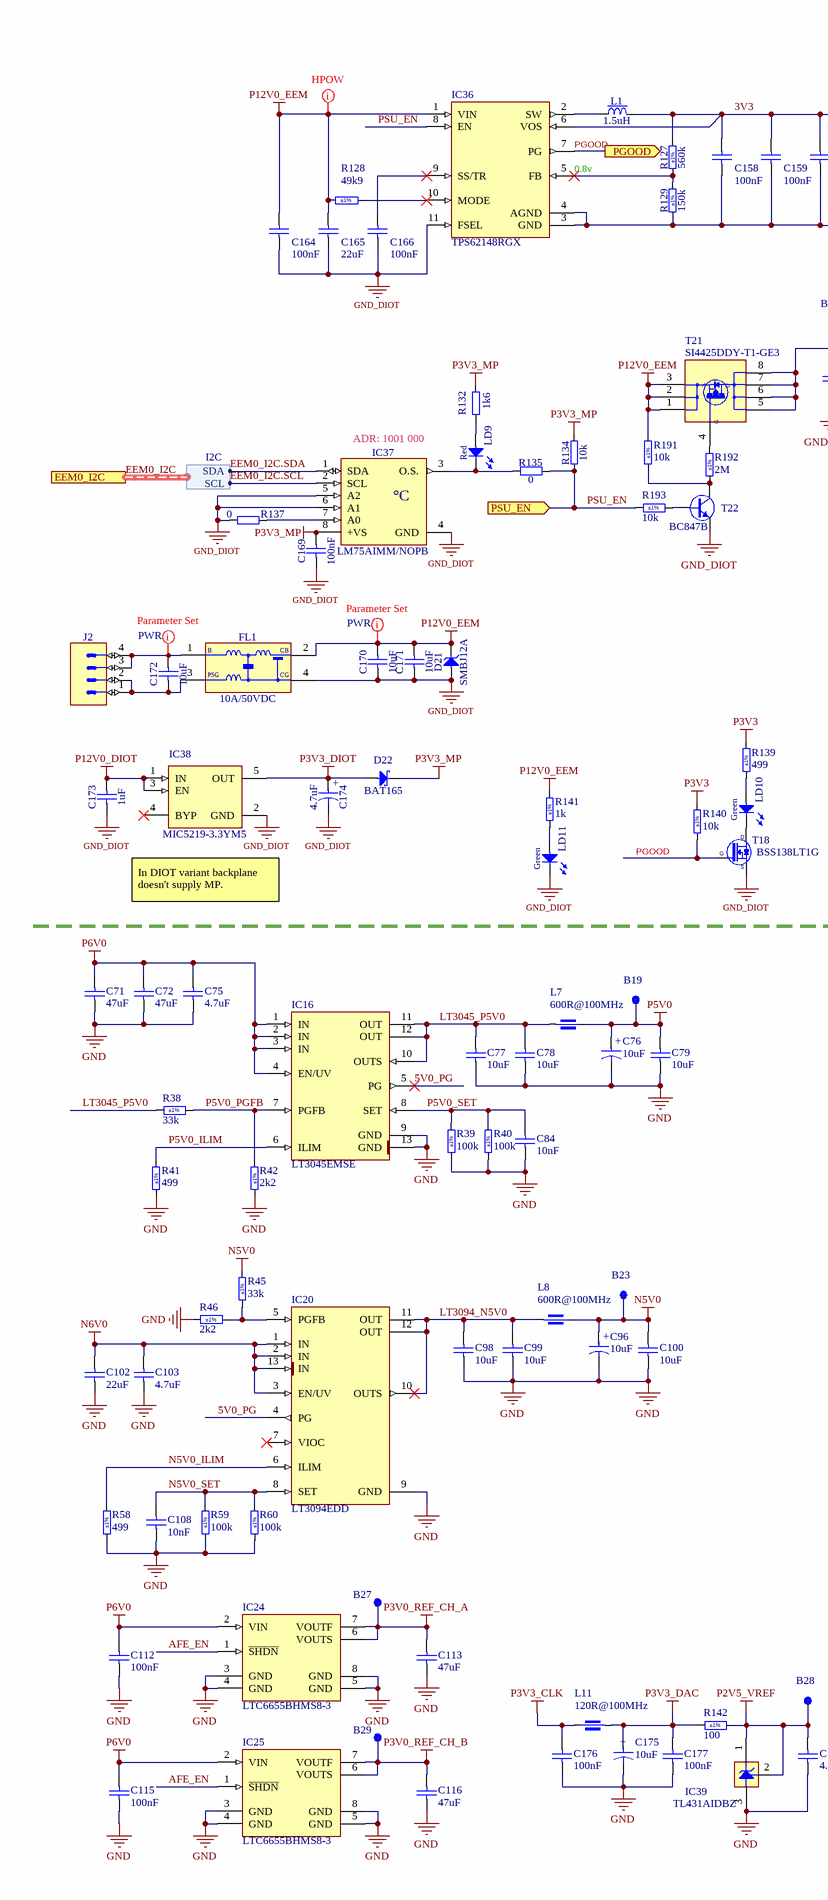
[diagram p9: Isolated_Power_supply.SchDoc, left]
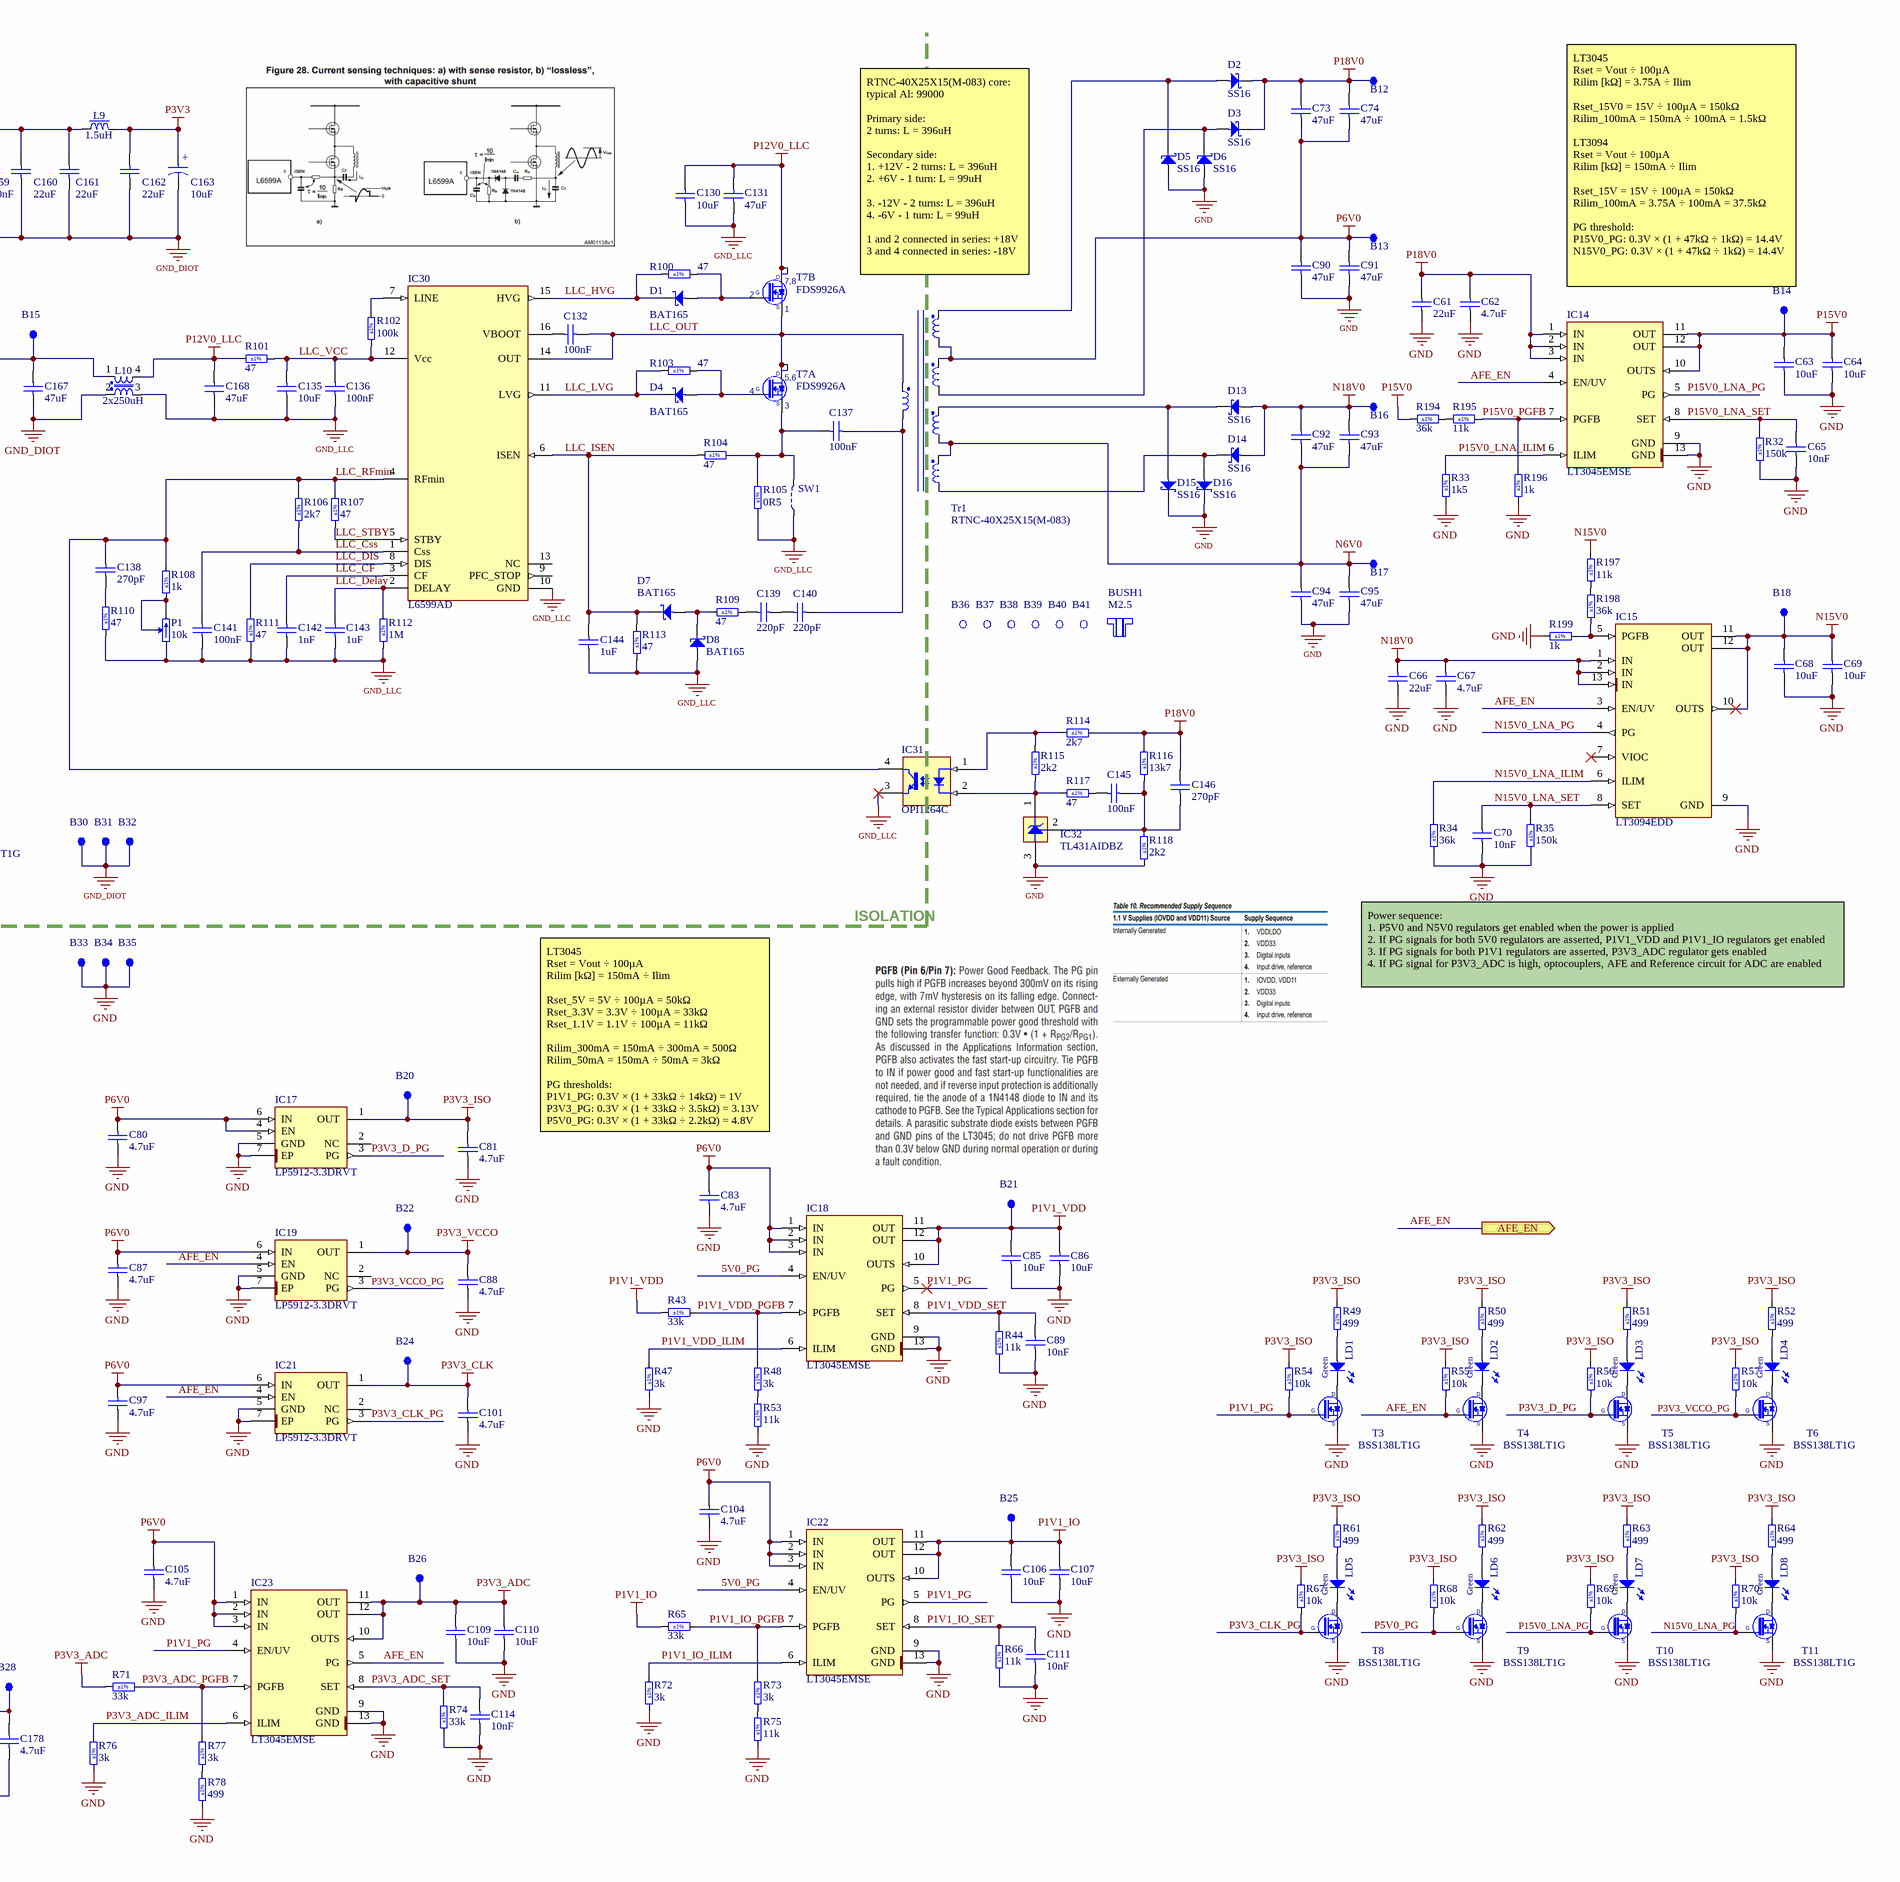
[diagram p10: Isolated_Power_supply.SchDoc, right]

### Parts
(Parts that share a designator on the sheet are numbered #1, #2 ... from top to bottom, then left to right.)
B12  SMD Pad  [C100]  (value not drawn)  (no BOM)
B13  SMD Pad  [C100]  (value not drawn)  (no BOM)
B14  SMD Pad  [C100]  (value not drawn)  (no BOM)
B15  SMD Pad  [C100]  (value not drawn)  (no BOM)
B16  SMD Pad  [C100]  (value not drawn)  (no BOM)
B17  SMD Pad  [C100]  (value not drawn)  (no BOM)
B18  SMD Pad  [C100]  (value not drawn)  (no BOM)
B19  SMD Pad  [C100]  (value not drawn)  (no BOM)
B20  SMD Pad  [C100]  (value not drawn)  (no BOM)
B21  SMD Pad  [C100]  (value not drawn)  (no BOM)
B22  SMD Pad  [C100]  (value not drawn)  (no BOM)
B23  SMD Pad  [C100]  (value not drawn)  (no BOM)
B24  SMD Pad  [C100]  (value not drawn)  (no BOM)
B25  SMD Pad  [C100]  (value not drawn)  (no BOM)
B26  SMD Pad  [C100]  (value not drawn)  (no BOM)
B27  SMD Pad  [C100]  (value not drawn)  (no BOM)
B28  SMD Pad  [C100]  (value not drawn)  (no BOM)
B29  SMD Pad  [C100]  (value not drawn)  (no BOM)
B30  SMD Pad  [C100]  (value not drawn)  (no BOM)
B31  SMD Pad  [C100]  (value not drawn)  (no BOM)
B32  SMD Pad  [C100]  (value not drawn)  (no BOM)
B33  SMD Pad  [C100]  (value not drawn)  (no BOM)
B34  SMD Pad  [C100]  (value not drawn)  (no BOM)
B35  SMD Pad  [C100]  (value not drawn)  (no BOM)
B36  Non Plated Hole  [MTG300]  (value not drawn)  (no BOM)
B37  Non Plated Hole  [MTG300]  (value not drawn)  (no BOM)
B38  Non Plated Hole  [MTG300]  (value not drawn)  (no BOM)
B39  Non Plated Hole  [MTG300]  (value not drawn)  (no BOM)
B40  Non Plated Hole  [MTG300]  (value not drawn)  (no BOM)
B41  Non Plated Hole  [MTG300]  (value not drawn)  (no BOM)
BUSH1  M2.5  [WURTH_9774010151]
C61  22uF  [CAPC2012X135N]
C62  4.7uF  [CAPC1608X90N]
C63  10uF  [CAPC2012X95N]
C64  10uF  [CAPC2012X95N]
C65  10nF  [CAPC1005X55N]
C66  22uF  [CAPC2012X135N]
C67  4.7uF  [CAPC1608X90N]
C68  10uF  [CAPC2012X95N]
C69  10uF  [CAPC2012X95N]
C70  10nF  [CAPC1005X55N]
C71  47uF  [CAPC3216X180N]
C72  47uF  [CAPC3216X180N]
C73  47uF  [CAPC3216X180N]
C74  47uF  [CAPC3216X180N]
C75  4.7uF  [CAPC1608X90N]
C76  10uF  [CAPMP3216X180N]
C77  10uF  [CAPC2012X95N]
C78  10uF  [CAPC2012X95N]
C79  10uF  [CAPC2012X95N]
C80  4.7uF  [CAPC1608X90N]
C81  4.7uF  [CAPC1608X90N]
C83  4.7uF  [CAPC1608X90N]
C84  10nF  [CAPC1005X55N]
C85  10uF  [CAPC2012X95N]
C86  10uF  [CAPC2012X95N]
C87  4.7uF  [CAPC1608X90N]
C88  4.7uF  [CAPC1608X90N]
C89  10nF  [CAPC1005X55N]
C90  47uF  [CAPC3216X180N]
C91  47uF  [CAPC3216X180N]
C92  47uF  [CAPC3216X180N]
C93  47uF  [CAPC3216X180N]
C94  47uF  [CAPC3216X180N]
C95  47uF  [CAPC3216X180N]
C96  10uF  [CAPMP3216X180N]
C97  4.7uF  [CAPC1608X90N]
C98  10uF  [CAPC2012X95N]
C99  10uF  [CAPC2012X95N]
C100  10uF  [CAPC2012X95N]
C101  4.7uF  [CAPC1608X90N]
C102  22uF  [CAPC2012X135N]
C103  4.7uF  [CAPC1608X90N]
C104  4.7uF  [CAPC1608X90N]
C105  4.7uF  [CAPC1608X90N]
C106  10uF  [CAPC2012X95N]
C107  10uF  [CAPC2012X95N]
C108  10nF  [CAPC1005X55N]
C109  10uF  [CAPC2012X95N]
C110  10uF  [CAPC2012X95N]
C111  10nF  [CAPC1005X55N]
C112  100nF  [CAPC1005X55N]
C113  47uF  [CAPC2012X140N]
C114  10nF  [CAPC1005X55N]
C115  100nF  [CAPC1005X55N]
C116  47uF  [CAPC2012X140N]
C130  10uF  [CAPC3216X180N]
C131  47uF  [CAPC3216X180N]
C132  100nF  [CAPC1005X55N]
C135  10uF  [CAPC3216X180N]
C136  100nF  [CAPC1005X55N]
C137  100nF  [CAPC4532X250N]
C138  270pF  [CAPC1608X87N]
C139  220pF  [CAPC3225X200N]
C140  220pF  [CAPC3225X200N]
C141  100nF  [CAPC1005X55N]
C142  1nF  [CAPC1608X90N]
C143  1uF  [CAPC1608X87N]
C144  1uF  [CAPC1608X87N]
C145  100nF  [CAPC1005X55N]
C146  270pF  [CAPC1608X87N]
C158  100nF  [CAPC1005X55N]
C159  100nF  [CAPC1005X55N]
C160  22uF  [CAPC2012X135N]
C161  22uF  [CAPC2012X135N]
C162  22uF  [CAPC2012X135N]
C163  10uF  [CAPMP3216X180N]
C164  100nF  [CAPC1005X55N]
C165  22uF  [CAPC2012X135N]
C166  100nF  [CAPC1005X55N]
C167  47uF  [CAPC3216X180N]
C168  47uF  [CAPC3216X180N]
C169  100nF  [CAPC1005X55N]
C170  10uF  [CAPC2012X95N]
C171  10uF  [CAPC2012X95N]
C172  10uF  [CAPC2012X95N]
C173  1uF  [CAPC1608X87N]
C174  4.7uF  [CAPMP3216X180N]
C175  10uF  [CAPMP3216X180N]
C176  100nF  [CAPC1005X55N]
C177  100nF  [CAPC1005X55N]
C178  4.7uF  [CAPC1608X90N]
D1  BAT165  [SOD2512X110N]
D2  SS16  [DIOM5127X229N]
D3  SS16  [DIOM5127X229N]
D4  BAT165  [SOD2512X110N]
D5#2  SS16  [DIOM5127X229N]
D6#2  SS16  [DIOM5127X229N]
D7#2  BAT165  [SOD2512X110N]
D8  BAT165  [SOD2512X110N]
D13  SS16  [DIOM5127X229N]
D14  SS16  [DIOM5127X229N]
D15  SS16  [DIOM5127X229N]
D16  SS16  [DIOM5127X229N]
D21  SMBJ12A  [DIOM5336X265N]
D22  BAT165  [SOD2512X110N]
FL1  10A/50VDC  [FIL_MURATA_BNX02]
IC14  LT3045EMSE  [SOP65P490X110-13N-R175X294]
IC15  LT3094EDD  [SON45P300X300X80-13N-R175X248]
IC16  LT3045EMSE  [SOP65P490X110-13N-R175X294]
IC17  LP5912-3.3DRVT  [SON65P200X200X80-7N-R110X170]
IC18  LT3045EMSE  [SOP65P490X110-13N-R175X294]
IC19  LP5912-3.3DRVT  [SON65P200X200X80-7N-R110X170]
IC20  LT3094EDD  [SON45P300X300X80-13N-R175X248]
IC21  LP5912-3.3DRVT  [SON65P200X200X80-7N-R110X170]
IC22  LT3045EMSE  [SOP65P490X110-13N-R175X294]
IC23  LT3045EMSE  [SOP65P490X110-13N-R175X294]
IC24  LTC6655BHMS8-3  [SOP65P490X110-8N]
IC25  LTC6655BHMS8-3  [SOP65P490X110-8N]
IC30  L6599AD  [SOP127P600X175-16N]
IC31  OPI1264C  [OPI1264C]
IC32  TL431AIDBZ  [SOT95P237X112-3N]
IC36  TPS62148RGX  [TEXAS_RGX0011A]
IC37  LM75AIMM/NOPB  [SOP65P490X109-8N]
IC38  MIC5219-3.3YM5  [SOT95P280X145-5N]
IC39  TL431AIDBZ  [SOT95P237X112-3N]
J2  Mini-Fit Jr.™  [MOLEX_39-30-0040]  (value not drawn)
L1  1.5uH  [IND_WURTH_WE-LHMI_7050]
L7  600R@100MHz  [INDC1608X95N]
L8  600R@100MHz  [INDC1608X95N]
L9  1.5uH  [IND_WURTH_WE-LHMI_7050]
L10  2x250uH  [IND_WURTH_WE-SL2]
L11  120R@100MHz  [INDC1608X65N]
LD1  Green  [LED_KINGBRIGHT_KP-1608CGCK]
LD2  Green  [LED_KINGBRIGHT_KP-1608CGCK]
LD3  Green  [LED_KINGBRIGHT_KP-1608CGCK]
LD4  Green  [LED_KINGBRIGHT_KP-1608CGCK]
LD5  Green  [LED_KINGBRIGHT_KP-1608CGCK]
LD6  Green  [LED_KINGBRIGHT_KP-1608CGCK]
LD7  Green  [LED_KINGBRIGHT_KP-1608CGCK]
LD8  Green  [LED_KINGBRIGHT_KP-1608CGCK]
LD9  Red  [LED_AVAGO_HSMC-C110]
LD10  Green  [LED_KINGBRIGHT_KP-1608CGCK]
LD11  Green  [LED_AVAGO_HSME-C110]
P1  10k  [TRIM_BOURNS_3314G-1]
R32  150k  Tolerance: ±1%  [RESC1005X40N]
R33  1k5  Tolerance: ±1%  [RESC1005X40N]
R34  36k  Tolerance: ±1%  [RESC1005X40N]
R35  150k  Tolerance: ±1%  [RESC1005X40N]
R38  33k  Tolerance: ±1%  [RESC1005X40N]
R39  100k  Tolerance: ±1%  [RESC1005X40N]
R40  100k  Tolerance: ±1%  [RESC1005X40N]
R41  499  Tolerance: ±1%  [RESC1005X40N]
R42  2k2  Tolerance: ±1%  [RESC1005X40N]
R43  33k  Tolerance: ±1%  [RESC1005X40N]
R44  11k  Tolerance: ±1%  [RESC1005X40N]
R45  33k  Tolerance: ±1%  [RESC1005X40N]
R46  2k2  Tolerance: ±1%  [RESC1005X40N]
R47  3k  Tolerance: ±1%  [RESC1005X40N]
R48  3k  Tolerance: ±1%  [RESC1005X40N]
R49  499  Tolerance: ±1%  [RESC1005X40N]
R50  499  Tolerance: ±1%  [RESC1005X40N]
R51  499  Tolerance: ±1%  [RESC1005X40N]
R52  499  Tolerance: ±1%  [RESC1005X40N]
R53  11k  Tolerance: ±1%  [RESC1005X40N]
R54  10k  Tolerance: ±1%  [RESC1005X40N]
R55  10k  Tolerance: ±1%  [RESC1005X40N]
R56  10k  Tolerance: ±1%  [RESC1005X40N]
R57  10k  Tolerance: ±1%  [RESC1005X40N]
R58  499  Tolerance: ±1%  [RESC1005X40N]
R59  100k  Tolerance: ±1%  [RESC1005X40N]
R60  100k  Tolerance: ±1%  [RESC1005X40N]
R61  499  Tolerance: ±1%  [RESC1005X40N]
R62  499  Tolerance: ±1%  [RESC1005X40N]
R63  499  Tolerance: ±1%  [RESC1005X40N]
R64  499  Tolerance: ±1%  [RESC1005X40N]
R65  33k  Tolerance: ±1%  [RESC1005X40N]
R66  11k  Tolerance: ±1%  [RESC1005X40N]
R67  10k  Tolerance: ±1%  [RESC1005X40N]
R68  10k  Tolerance: ±1%  [RESC1005X40N]
R69  10k  Tolerance: ±1%  [RESC1005X40N]
R70  10k  Tolerance: ±1%  [RESC1005X40N]
R71  33k  Tolerance: ±1%  [RESC1005X40N]
R72  3k  Tolerance: ±1%  [RESC1005X40N]
R73  3k  Tolerance: ±1%  [RESC1005X40N]
R74  33k  Tolerance: ±1%  [RESC1005X40N]
R75  11k  Tolerance: ±1%  [RESC1005X40N]
R76  3k  Tolerance: ±1%  [RESC1005X40N]
R77  3k  Tolerance: ±1%  [RESC1005X40N]
R78  499  Tolerance: ±1%  [RESC1005X40N]
R100  47  Tolerance: ±1%  [RESC1608X55N]
R101  47  Tolerance: ±1%  [RESC1608X55N]
R102  100k  Tolerance: ±1%  [RESC1005X40N]
R103  47  Tolerance: ±1%  [RESC1608X55N]
R104  47  Tolerance: ±1%  [RESC1608X55N]
R105  0R5  Tolerance: ±1%  [RESC6532X80N]
R106  2k7  Tolerance: ±1%  [RESC1608X55N]
R107  47  Tolerance: ±1%  [RESC1608X55N]
R108  1k  Tolerance: ±1%  [RESC1005X40N]
R109  47  Tolerance: ±1%  [RESC1608X55N]
R110  47  Tolerance: ±1%  [RESC1608X55N]
R111  47  Tolerance: ±1%  [RESC1608X55N]
R112  1M  Tolerance: ±1%  [RESC1608X55N]
R113  47  Tolerance: ±1%  [RESC1608X55N]
R114  2k7  Tolerance: ±1%  [RESC1608X55N]
R115  2k2  Tolerance: ±1%  [RESC1005X40N]
R116  13k7  Tolerance: ±1%  [RESC1608X55N]
R117  47  Tolerance: ±1%  [RESC1608X55N]
R118  2k2  Tolerance: ±1%  [RESC1005X40N]
R127  560k  Tolerance: ±1%  [RESC1608X55N]
R128  49k9  Tolerance: ±1%  [RESC1608X55N]
R129  150k  Tolerance: ±1%  [RESC1608X55N]
R132#2  1k6  [RESC1005X40N]
R134#2  10k  [RESC1608X55N]
R135#2  0  [RESC1005X40N]
R137#2  0  [RESC1005X40N]
R139#2  499  Tolerance: ±1%  [RESC1005X40N]
R140#2  10k  Tolerance: ±1%  [RESC1005X40N]
R141  1k  Tolerance: ±1%  [RESC1005X40N]
R142  100  Tolerance: ±1%  [RESC1005X40N]
R191  10k  Tolerance: ±1%  [RESC1005X40N]
R192  2M  Tolerance: ±1%  [RESC1005X40N]
R193  10k  Tolerance: ±1%  [RESC1005X40N]
R194  36k  Tolerance: ±1%  [RESC1005X40N]
R195  11k  Tolerance: ±1%  [RESC1005X40N]
R196  1k  Tolerance: ±1%  [RESC1005X40N]
R197  11k  Tolerance: ±1%  [RESC1005X40N]
R198  36k  Tolerance: ±1%  [RESC1005X40N]
R199  1k  Tolerance: ±1%  [RESC1005X40N]
SW1  Switch  [JUMPSMD0805_G50]  (value not drawn)  (no BOM)
T3  BSS138LT1G  [SOT95P240X110-3N]
T4  BSS138LT1G  [SOT95P240X110-3N]
T5  BSS138LT1G  [SOT95P240X110-3N]
T6  BSS138LT1G  [SOT95P240X110-3N]
T7  FDS9926A  [SOIC127P600X175-8N]  (parts A,B of 2)
T8  BSS138LT1G  [SOT95P240X110-3N]
T9  BSS138LT1G  [SOT95P240X110-3N]
T10  BSS138LT1G  [SOT95P240X110-3N]
T11  BSS138LT1G  [SOT95P240X110-3N]
T18  BSS138LT1G  [SOT95P240X110-3N]
T21  SI4425DDY-T1-GE3  [SOIC127P600X175-8N]
T22  BC847B  [SOT95P230X110-3N]
Tr1  RTNC-40X25X15(M-083)  [RTNC-40X25X15(M-083)]

### Ports
AFE_EN (out), EEM0_I2C (harness I2C), PGOOD (out), PSU_EN (in)

### Harnesses
I2C: SDA, SCL

### Nets
GND: B30.1 B31.1 B32.1 B33.1 B34.1 B35.1 C61.1 C62.1 C63.1 C64.1 C65.1 C66.1 C67.1 C68.1 C69.1 C70.1 C71.1 C72.1 C75.1 C76.2 C77.1 C78.1 C79.1 C80.1 C81.1 C83.1 C84.1 C85.1 C86.1 C87.1 C88.1 C89.1 C90.2 C91.2 C94.2 C95.2 C96.2 C97.1 C98.1 C99.1 C100.1 C101.1 C102.1 C103.1 C104.1 C105.1 C106.1 C107.1 C108.1 C109.1 C110.1 C111.1 C112.1 C113.1 C114.1 C115.1 C116.1 C158.1 C159.1 C160.1 C161.1 C162.1 C163.2 C164.1 C165.1 C166.1 C167.1 C169.1 C170.1 C171.1 C173.1 C174.2 C175.2 C176.1 C177.1 C178.1 D5#2.2(A) D6#2.2(A) D15.1(C) D16.1(C) D21.2(A) FL1.4(CG) IC14.9(GND) IC14.13(GND) IC15.9(GND) IC16.9(GND) IC16.13(GND) IC17.5(GND) IC17.7(EP) IC18.9(GND) IC18.13(GND) IC19.5(GND) IC19.7(EP) IC20.9(GND) IC21.5(GND) IC21.7(EP) IC22.9(GND) IC22.13(GND) IC23.9(GND) IC23.13(GND) IC24.3(GND) IC24.4(GND) IC24.5(GND) IC24.8(GND) IC25.3(GND) IC25.4(GND) IC25.5(GND) IC25.8(GND) IC32.3(A) IC36.3(GND) IC36.4(AGND) IC36.11(FSEL) IC37.4(GND) IC37.5(A2) IC37.6(A1) IC38.2(GND) IC39.3(A) L10.2 LD11.1(C) R32.1 R33.1 R34.1 R35.1 R39.1 R40.1 R41.1 R42.1 R44.1 R46.2 R47.1 R53.1 R58.1 R59.1 R60.1 R66.1 R72.1 R74.1 R75.1 R76.1 R78.1 R118.1 R129.1 R137#2.1 R196.1 R199.2 T3.2(S) T4.2(S) T5.2(S) T6.2(S) T8.2(S) T9.2(S) T10.2(S) T11.2(S) T18.2(S) T22.2(E)  [also labelled GND_DIOT]
GND_LLC: C130.2 C131.2 C135.2 C136.1 C141.2 C142.1 C143.1 C144.1 C168.1 D8.2(A) IC30.10(GND) IC31.3(E) L10.3 P1.1(CCW) R105.1 R110.1 R111.1 R112.1 R113.1 SW1.1
N5V0: B23.1 C96.1 C100.2 L8.2 R45.2
N6V0: B17.1 C92.2 C93.2 C94.1 C95.1 C102.2 C103.2 IC20.1(IN) IC20.2(IN) IC20.3(EN/UV) IC20.13(IN) Tr1.8 Tr1.9
N15V0: B18.1 C68.2 C69.2 IC15.10(OUTS) IC15.11(OUT) IC15.12(OUT) R197.2
N18V0: B16.1 C66.2 C67.2 C92.1 C93.1 D13.2(A) D14.2(A) IC15.1(IN) IC15.2(IN) IC15.13(IN)
P1V1_IO: B25.1 C106.2 C107.2 IC22.10(OUTS) IC22.11(OUT) IC22.12(OUT) R65.2
P1V1_VDD: B21.1 C85.2 C86.2 IC18.10(OUTS) IC18.11(OUT) IC18.12(OUT) R43.2
P2V5_VREF: B28.1 C178.2 IC39.1(C) IC39.2(Adj) R142.1
P3V0_REF_CH_A: B27.1 B29.1 C113.2 C116.2 IC24.6(VOUTS) IC24.7(VOUTF) IC25.6(VOUTS) IC25.7(VOUTF)  [also labelled P3V0_REF_CH_B]  [project net P3V0_REF]
P3V3: C162.2 C163.1 L9.2 R139#2.2 R140#2.2
P3V3_ADC: B26.1 C109.2 C110.2 IC23.10(OUTS) IC23.11(OUT) IC23.12(OUT) R71.2
P3V3_CLK: B24.1 C101.2 C176.2 IC21.1(OUT) L11.2
P3V3_DAC: C175.1 C177.2 L11.1 R142.2
P3V3_DIOT: C174.1 D22.2(A) IC38.5(OUT)
P3V3_ISO: B20.1 C81.2 IC17.1(OUT) R49.2 R50.2 R51.2 R52.2 R54.2 R55.2 R56.2 R57.2 R61.2 R62.2 R63.2 R64.2 R67.2 R68.2 R69.2 R70.2
P3V3_MP: C169.2 D22.1(C) IC37.8(+VS) R132#2.2 R134#2.2
P3V3_VCCO: B22.1 C88.2 IC19.1(OUT)
P5V0: B19.1 C76.1 C79.2 L7.2
P6V0: B13.1 C71.2 C72.2 C73.2 C74.2 C75.2 C80.2 C83.2 C87.2 C90.1 C91.1 C97.2 C104.2 C105.2 C112.2 C115.2 IC16.1(IN) IC16.2(IN) IC16.3(IN) IC16.4(EN/UV) IC17.4(EN) IC17.6(IN) IC18.1(IN) IC18.2(IN) IC18.3(IN) IC19.6(IN) IC21.6(IN) IC22.1(IN) IC22.2(IN) IC22.3(IN) IC23.1(IN) IC23.2(IN) IC23.3(IN) IC24.2(VIN) IC25.2(VIN) Tr1.4 Tr1.5
P12V0_DIOT: C173.2 IC38.1(IN) IC38.3(EN)
P12V0_EEM: C164.2 C165.2 C170.2 C171.2 D21.1(C) FL1.2(CB) IC36.1(VIN) R128.1 R141.2 R191.1 T21.1(S) T21.2(S) T21.3(S)
P12V0_LLC: C130.1 C131.1 C168.2 L10.4 R101.2 T7.7(D) T7.8(D)
P15V0: B14.1 C63.2 C64.2 IC14.10(OUTS) IC14.11(OUT) IC14.12(OUT) R194.1
P18V0: B12.1 C61.2 C62.2 C73.1 C74.1 C146.2 D2.1(C) D3.1(C) IC14.1(IN) IC14.2(IN) IC14.3(IN) R114.1 R116.2
3V3: C158.2 C159.2 C160.2 C161.2 IC36.6(VOS) L1.2 L9.1 R127.2
5V0_PG: IC16.5(PG) IC18.4(EN/UV) IC20.4(PG) IC22.4(EN/UV)
AFE_EN: IC14.4(EN/UV) IC15.3(EN/UV) IC19.4(EN) IC21.4(EN) IC23.5(PG) IC24.1(~{SHDN}) IC25.1(~{SHDN}) R55.1 T4.1(G) ; port AFE_EN
EEM0_I2C.SCL: IC37.2(SCL) ; port EEM0_I2C.SCL
EEM0_I2C.SDA: IC37.1(SDA) ; port EEM0_I2C.SDA
LLC_CF: C142.2 IC30.3(CF)
LLC_Css: C141.1 IC30.1(Css) R106.1
LLC_Delay: C143.2 IC30.2(DELAY) R112.2
LLC_DIS: IC30.8(DIS) R111.2
LLC_HVG: D1.1(C) IC30.15(HVG) R100.1
LLC_ISEN: C144.2 D7#2.1(C) IC30.6(ISEN) R104.2 R113.2
LLC_LVG: D4.1(C) IC30.11(LVG) R103.1
LLC_OUT: C132.1 IC30.14(OUT) T7.1(S) T7.5(D) T7.6(D) Tr1.1
LLC_RFmin: C138.2 IC30.4(RFmin) IC31.4(C) R106.2 R107.2 R108.2
LLC_STBY: IC30.5(STBY) R107.1
LLC_VCC: C135.1 C136.2 IC30.12(Vcc) R101.1 R102.1
LT3045_P5V0: C77.2 C78.2 IC16.10(OUTS) IC16.11(OUT) IC16.12(OUT) L7.1 R38.2
LT3094_N5V0: C98.2 C99.2 IC20.10(OUTS) IC20.11(OUT) IC20.12(OUT) L8.1
N5V0_ILIM: IC20.6(ILIM) R58.2
N5V0_SET: C108.2 IC20.8(SET) R59.2 R60.2
N15V0_LNA_ILIM: IC15.6(ILIM) R34.2
N15V0_LNA_PG: IC15.4(PG) R70.1 T11.1(G)
N15V0_LNA_SET: C70.2 IC15.8(SET) R35.2
P1V1_IO_ILIM: IC22.6(ILIM) R72.2
P1V1_IO_PGFB: IC22.7(PGFB) R65.1 R73.2
P1V1_IO_SET: C111.2 IC22.8(SET) R66.2
P1V1_PG: IC18.5(PG) IC22.5(PG) IC23.4(EN/UV) R54.1 T3.1(G)
P1V1_VDD_ILIM: IC18.6(ILIM) R47.2
P1V1_VDD_PGFB: IC18.7(PGFB) R43.1 R48.2
P1V1_VDD_SET: C89.2 IC18.8(SET) R44.2
P3V3_ADC_ILIM: IC23.6(ILIM) R76.2
P3V3_ADC_PGFB: IC23.7(PGFB) R71.1 R77.2
P3V3_ADC_SET: C114.2 IC23.8(SET) R74.2
P3V3_CLK_PG: IC21.3(PG) R67.1 T8.1(G)
P3V3_D_PG: IC17.3(PG) R56.1 T5.1(G)
P3V3_VCCO_PG: IC19.3(PG) R57.1 T6.1(G)
P5V0_ILIM: IC16.6(ILIM) R41.2
P5V0_PG: R68.1 T9.1(G)
P5V0_PGFB: IC16.7(PGFB) R38.1 R42.2
P5V0_SET: C84.2 IC16.8(SET) R39.2 R40.2
P15V0_LNA_ILIM: IC14.6(ILIM) R33.2
P15V0_LNA_PG: IC14.5(PG) R69.1 T10.1(G)
P15V0_LNA_SET: C65.2 IC14.8(SET) R32.2
P15V0_PGFB: IC14.7(PGFB) R195.2 R196.2
PGOOD: IC36.7(PG) R140#2.1 T18.1(G) ; port PGOOD
PSU_EN: IC36.8(EN) R134#2.1 R135#2.2 R193.2 ; port PSU_EN
NetB15_1: B15.1 C167.2 L10.1 T21.5(D) T21.6(D) T21.7(D) T21.8(D)
NetC132_2: C132.2 IC30.16(VBOOT)
NetC137_1: C137.1 R104.1 R105.2 SW1.2 T7.3(S)
NetC137_2: C137.2 C140.2 Tr1.2
NetC138_1: C138.1 R110.2
NetC139_1: C139.1 R109.1
NetC139_2: C139.2 C140.1
NetC145_1: C145.1 C146.1 IC32.2(Adj) R116.1 R118.2
NetC145_2: C145.2 R117.1
NetC166_2: C166.2 IC36.9(SS/TR)
NetC172_1: C172.1 FL1.3(PSG) J2.1 J2.2
NetC172_2: C172.2 FL1.1(B) J2.3 J2.4
NetD1_2: D1.2(A) R100.2 T7.2(G)
NetD2_2: D2.2(A) D5#2.1(C) Tr1.3
NetD3_2: D3.2(A) D6#2.1(C) Tr1.6
NetD4_2: D4.2(A) R103.2 T7.4(G)
NetD7#2_2: D7#2.2(A) D8.1(C) R109.2
NetD13_1: D13.1(C) D15.2(A) Tr1.7
NetD14_1: D14.1(C) D16.2(A) Tr1.10
NetIC15_5: IC15.5(PGFB) R198.1 R199.1
NetIC20_5: IC20.5(PGFB) R45.1 R46.1
NetIC30_7: IC30.7(LINE) R102.2
NetIC31_1: IC31.1(A) R114.2 R115.2
NetIC31_2: IC31.2(C) IC32.1(C) R115.1 R117.2
NetIC36_2: IC36.2(SW) L1.1
NetIC36_5: IC36.5(FB) R127.1 R129.2
NetIC36_10: IC36.10(MODE) R128.2
NetIC37_3: IC37.3(O.S.) LD9.1(C) R135#2.1
NetIC37_7: IC37.7(A0) R137#2.2
NetLD1_1: LD1.1(C) T3.3(D)
NetLD1_2: LD1.2(A) R49.1
NetLD2_1: LD2.1(C) T4.3(D)
NetLD2_2: LD2.2(A) R50.1
NetLD3_1: LD3.1(C) T5.3(D)
NetLD3_2: LD3.2(A) R51.1
NetLD4_1: LD4.1(C) T6.3(D)
NetLD4_2: LD4.2(A) R52.1
NetLD5_1: LD5.1(C) T8.3(D)
NetLD5_2: LD5.2(A) R61.1
NetLD6_1: LD6.1(C) T9.3(D)
NetLD6_2: LD6.2(A) R62.1
NetLD7_1: LD7.1(C) T10.3(D)
NetLD7_2: LD7.2(A) R63.1
NetLD8_1: LD8.1(C) T11.3(D)
NetLD8_2: LD8.2(A) R64.1
NetLD9_2: LD9.2(A) R132#2.1
NetLD10_1: LD10.1(C) T18.3(D)
NetLD10_2: LD10.2(A) R139#2.1
NetLD11_2: LD11.2(A) R141.1
NetP1_2: P1.2(W) P1.3(CW) R108.1
NetR48_1: R48.1 R53.2
NetR73_1: R73.1 R75.2
NetR77_1: R77.1 R78.2
NetR191_2: R191.2 R192.1 T22.3(C)
NetR192_2: R192.2 T21.4(S)
NetR193_1: R193.1 T22.1(B)
NetR194_2: R194.2 R195.1
NetR197_1: R197.1 R198.2

Not connected (* = marked no-connect by the designer): B36 1; B37 1; B38 1; B39 1; B40 1; B41 1; BUSH1 1; IC15 7(VIOC)*; IC17 2(NC); IC19 2(NC); IC20 7(VIOC)*; IC21 2(NC); IC30 9(PFC_STOP) 13(NC); IC38 4(BYP)*

### Buses and harness runs
harness EEM0_I2C = port EEM0_I2C

### Layout directives
net class PWR: NetC172_2, P12V0_EEM
net class HPOW: P12V0_EEM

### Notes on the sheet
- (near IC36) 0.8v
- (near Tr1) RTNC-40X25X15(M-083) core:
  typical Al: 99000
  Primary side:
  2 turns: L = 396uH
  Secondary side:
  1. +12V - 2 turns: L = 396uH
  2. +6V - 1 turn: L = 99uH
  3. -12V - 2 turns: L = 396uH
  4. -6V - 1 turn: L = 99uH
  1 and 2 connected in series: +18V
  3 and 4 connected in series: -18V
- (near B14) LT3045
  Rset = Vout ÷ 100µA
  Rilim [kΩ] = 3.75A ÷ Ilim
  Rset_15V0 = 15V ÷ 100µA = 150kΩ
  Rilim_100mA = 150mA ÷ 100mA = 1.5kΩ
  LT3094
  Rset = Vout ÷ 100µA
  Rilim [kΩ] = 150mA ÷ Ilim
  Rset_15V = 15V ÷ 100µA = 150kΩ
  Rilim_100mA = 3.75A ÷ 100mA = 37.5kΩ
  PG threshold:
  P15V0_PG: 0.3V × (1 + 47kΩ ÷ 1kΩ) = 14.4V
  N15V0_PG: 0.3V × (1 + 47kΩ ÷ 1kΩ) = 14.4V
- (near IC37) ADR: 1001 000
- In DIOT variant backplane doesn't supply MP.
- ISOLATION
- Power sequence:
  1. P5V0 and N5V0 regulators get enabled when the power is applied
  2. If PG signals for both 5V0 regulators are asserted, P1V1_VDD and P1V1_IO regulators get enabled
  3. If PG signals for both P1V1 regulators are asserted, P3V3_ADC regulator gets enabled
  4. If PG signal for P3V3_ADC is high, optocouplers, AFE and Reference circuit for ADC are enabled
- LT3045
  Rset = Vout ÷ 100µA
  Rilim [kΩ] = 150mA ÷ Ilim
  Rset_5V = 5V ÷ 100µA = 50kΩ
  Rset_3.3V = 3.3V ÷ 100µA = 33kΩ
  Rset_1.1V = 1.1V ÷ 100µA = 11kΩ
  Rilim_300mA = 150mA ÷ 300mA = 500Ω
  Rilim_50mA = 150mA ÷ 50mA = 3kΩ
  PG thresholds:
  P1V1_PG: 0.3V × (1 + 33kΩ ÷ 14kΩ) = 1V
  P3V3_PG: 0.3V × (1 + 33kΩ ÷ 3.5kΩ) = 3.13V
  P5V0_PG: 0.3V × (1 + 33kΩ ÷ 2.2kΩ) = 4.8V
- Project/Equipment
- Document
- Designer
- Drawn by
- Check.by
- Last Mod.
- Contact
- File
- Print Date
- Sheet
- Size
- A2
- of
- Rev
- (in symbol CTE3216-18_4.7UF_10V_10%_AVX_TPSA475K010T1400) +
- (in symbol CTE3216-18_10UF_10V_10%_LESR1800) +
- (in symbol CTE3216-18_10UF_16V_20%_AVX_TCJ) +
- (in symbol FDS9926A, part A) 5,6
- (in symbol FDS9926A, part B) 7,8
- (in symbol LM75AIMM/NOPB) °C
- (in symbol Si4425DDY-T1-GE3) G